# EAGLE board Rev_must_do_it,,,,,,,,,,, (EAGLE 9.3.0), part 1 of 2
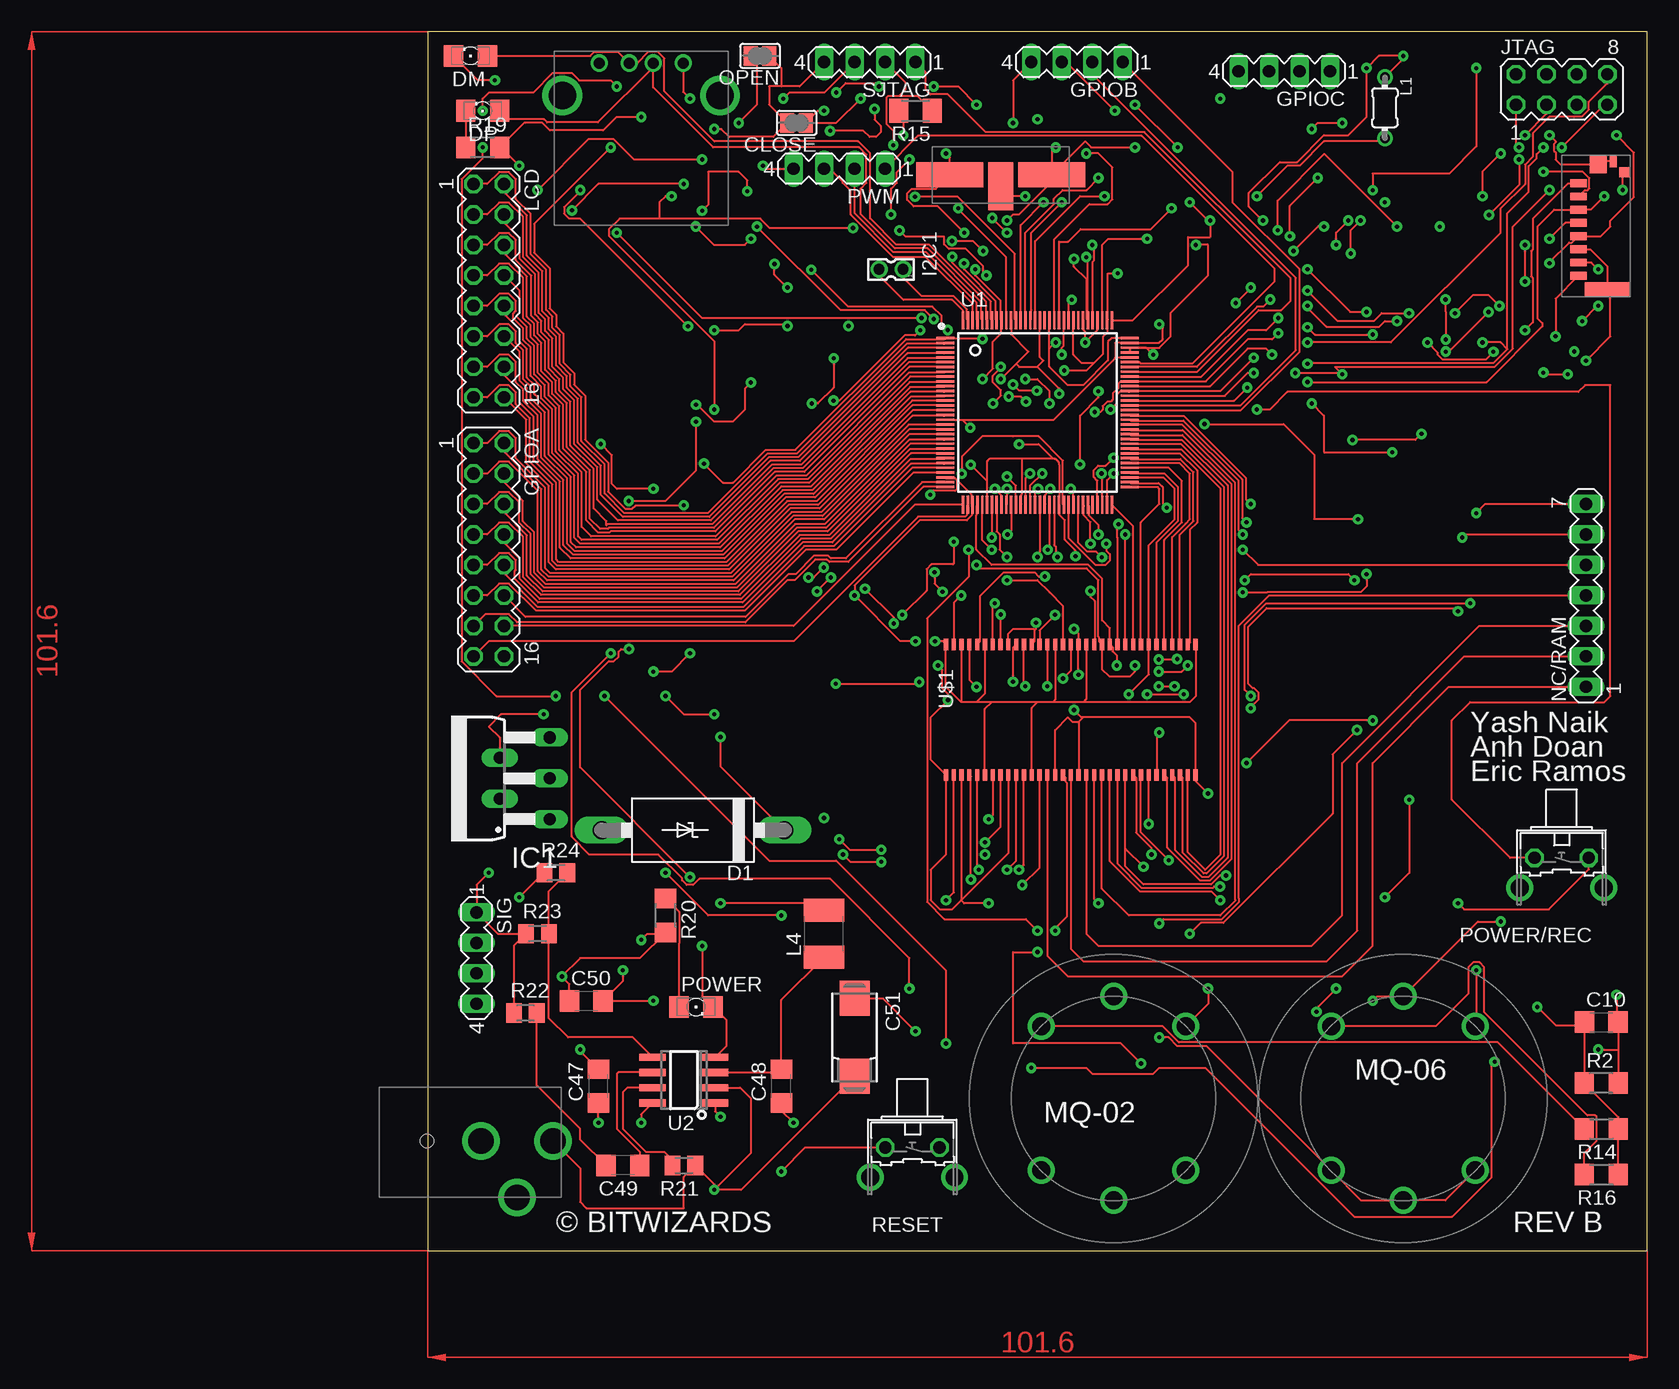
[diagram p4: board, top side]
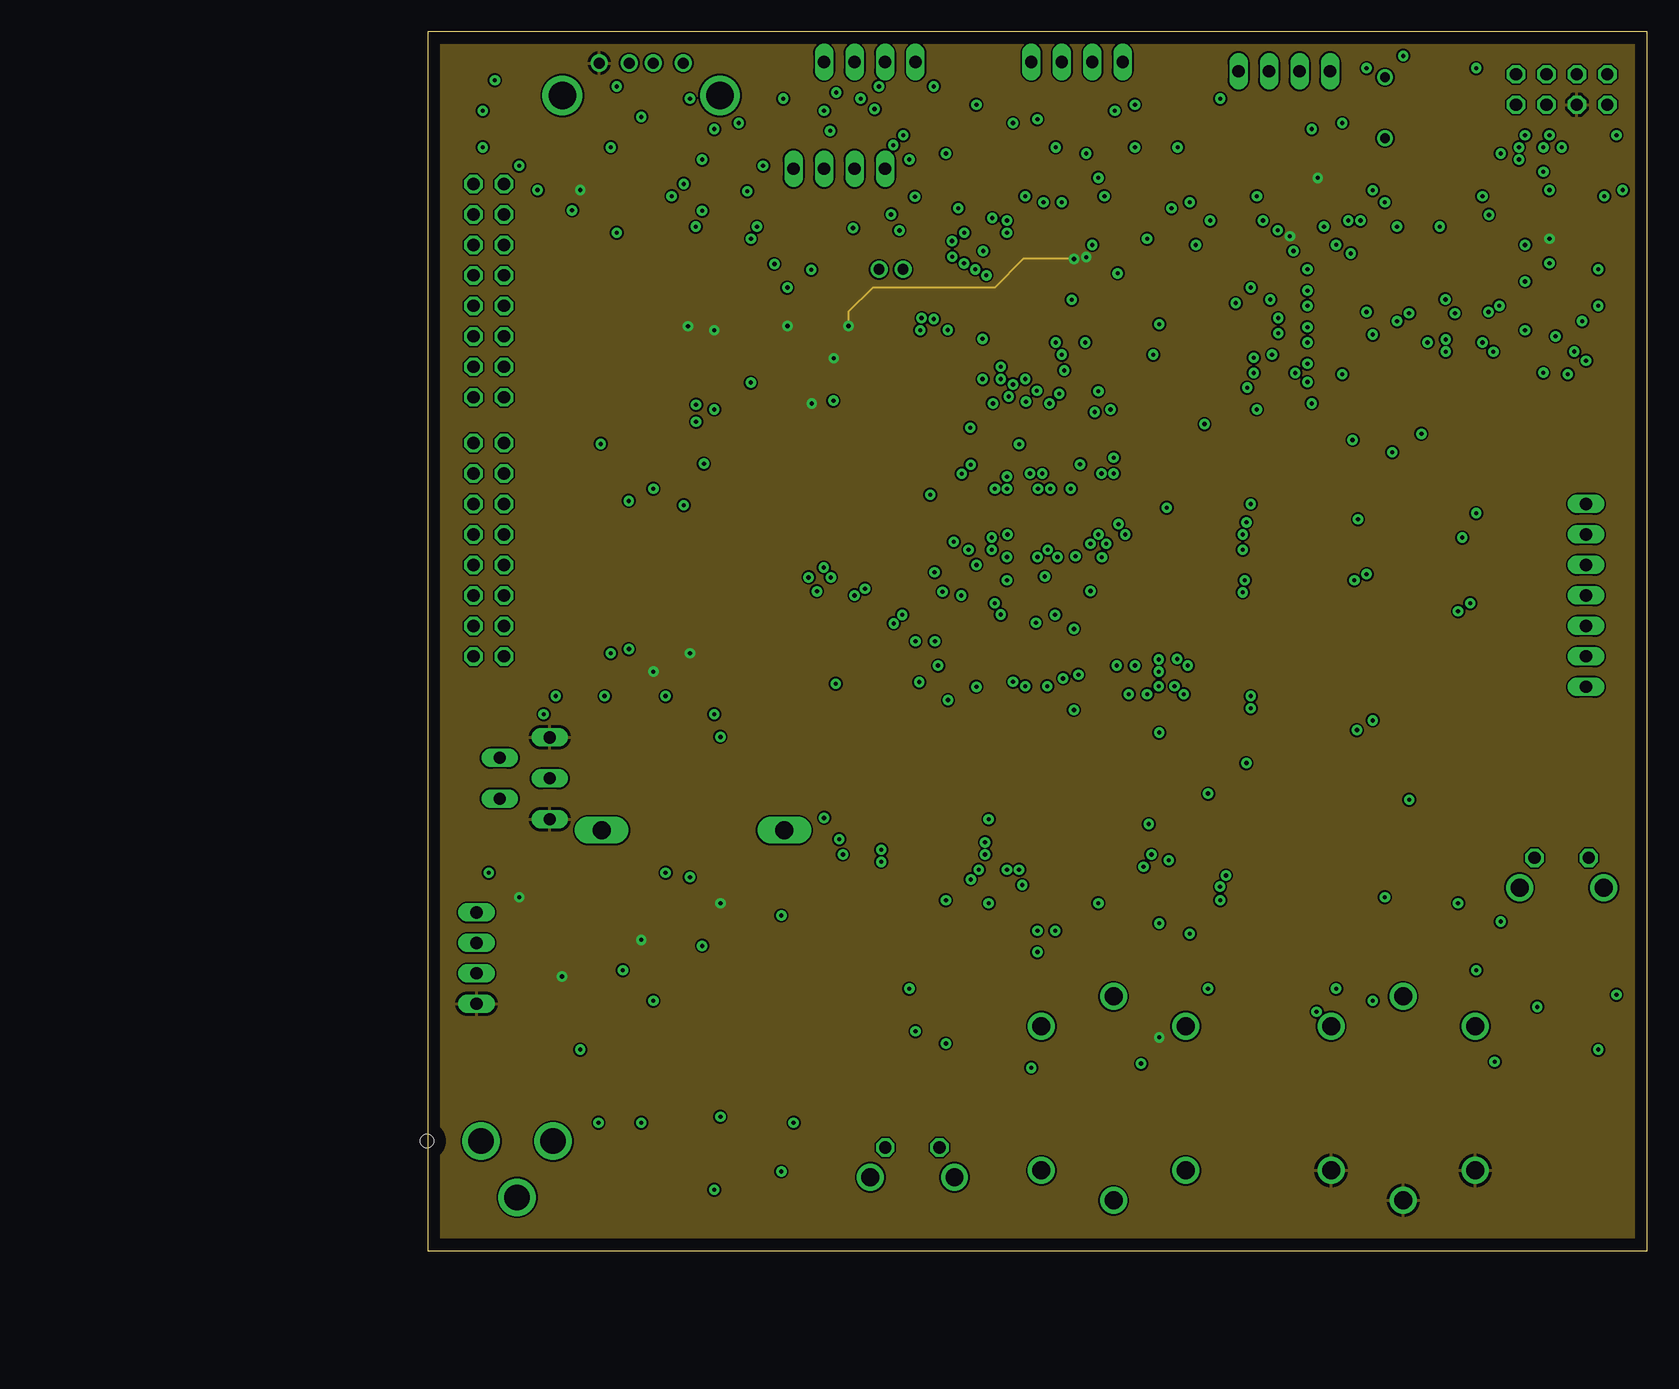
[diagram p5: board, inner layer +5VEXT]
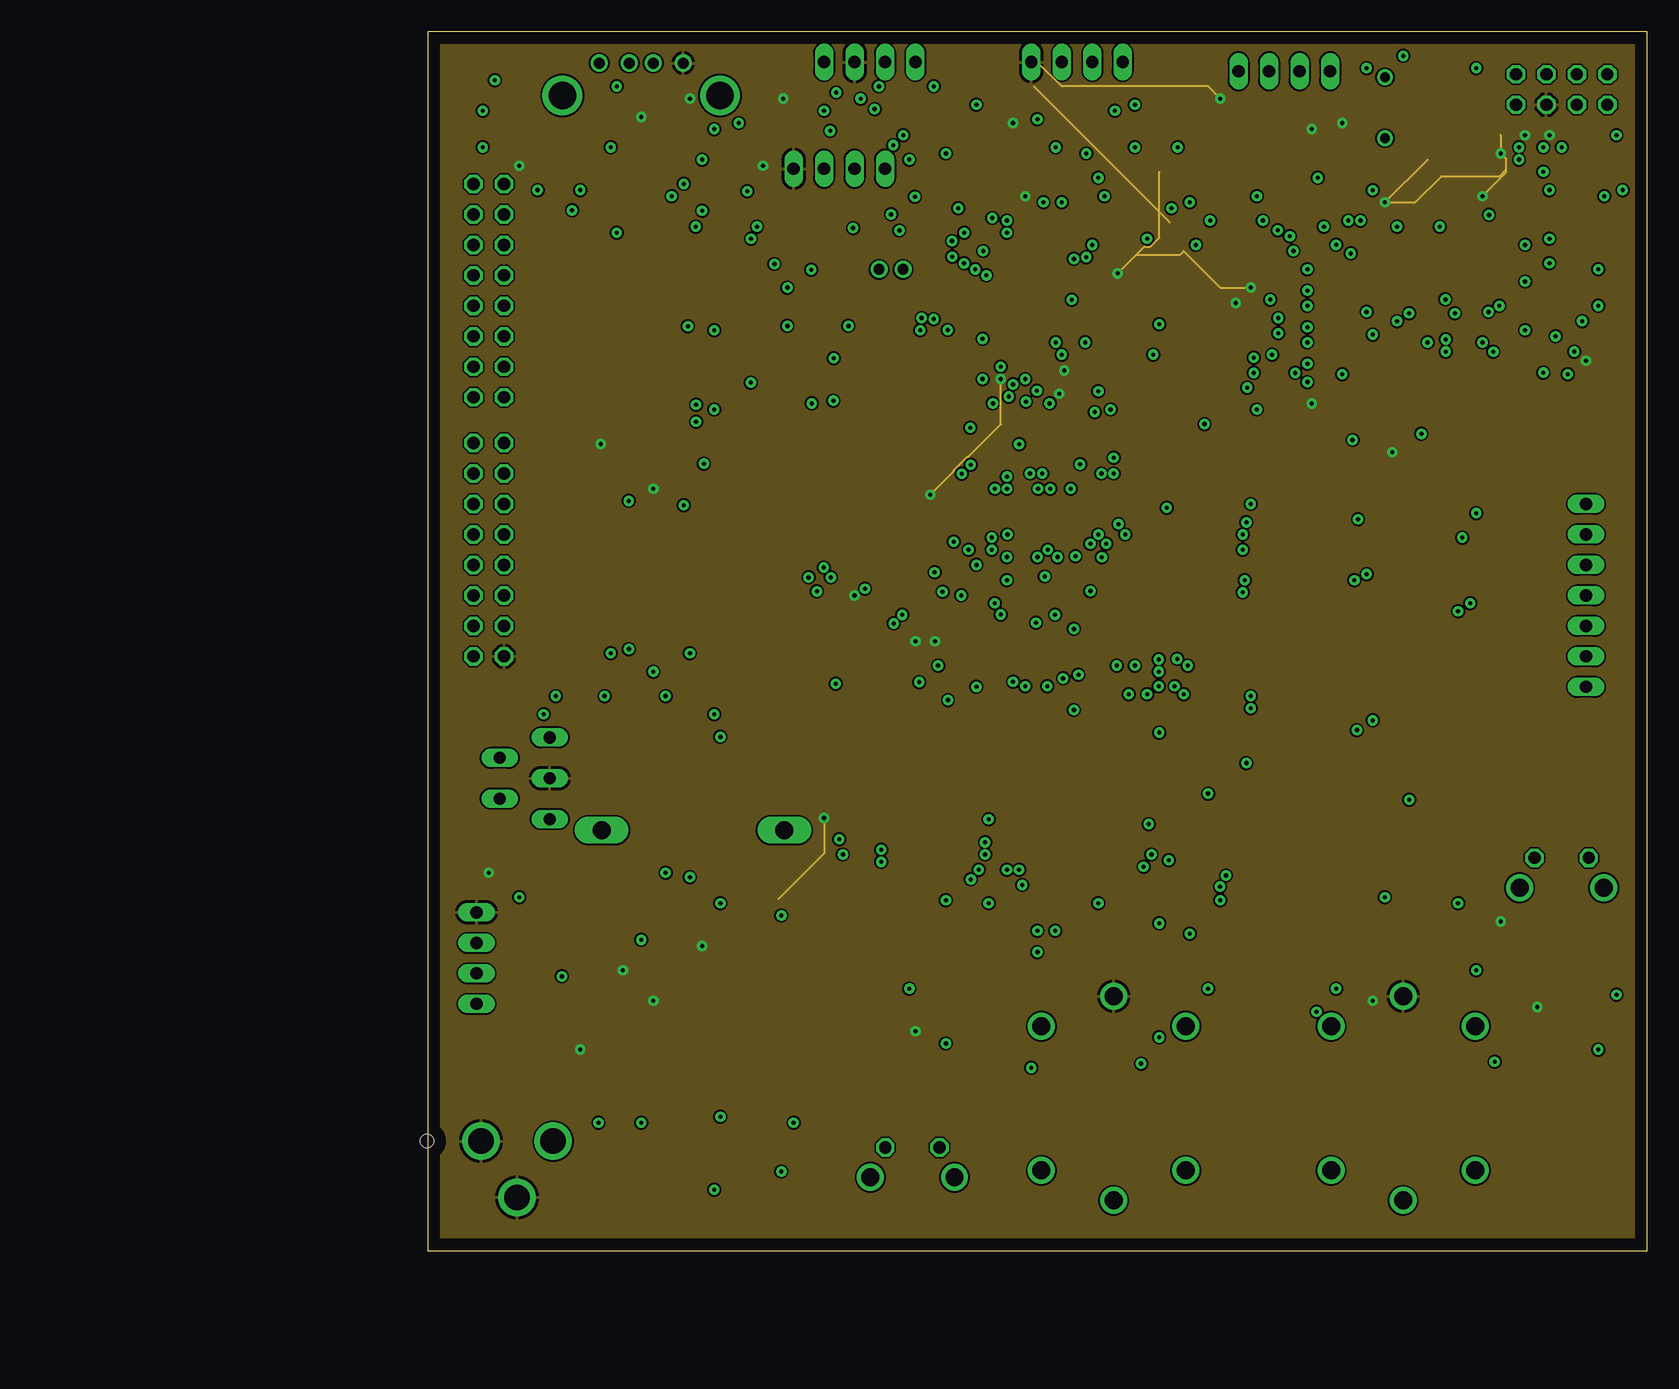
[diagram p6: board, inner layer GND]
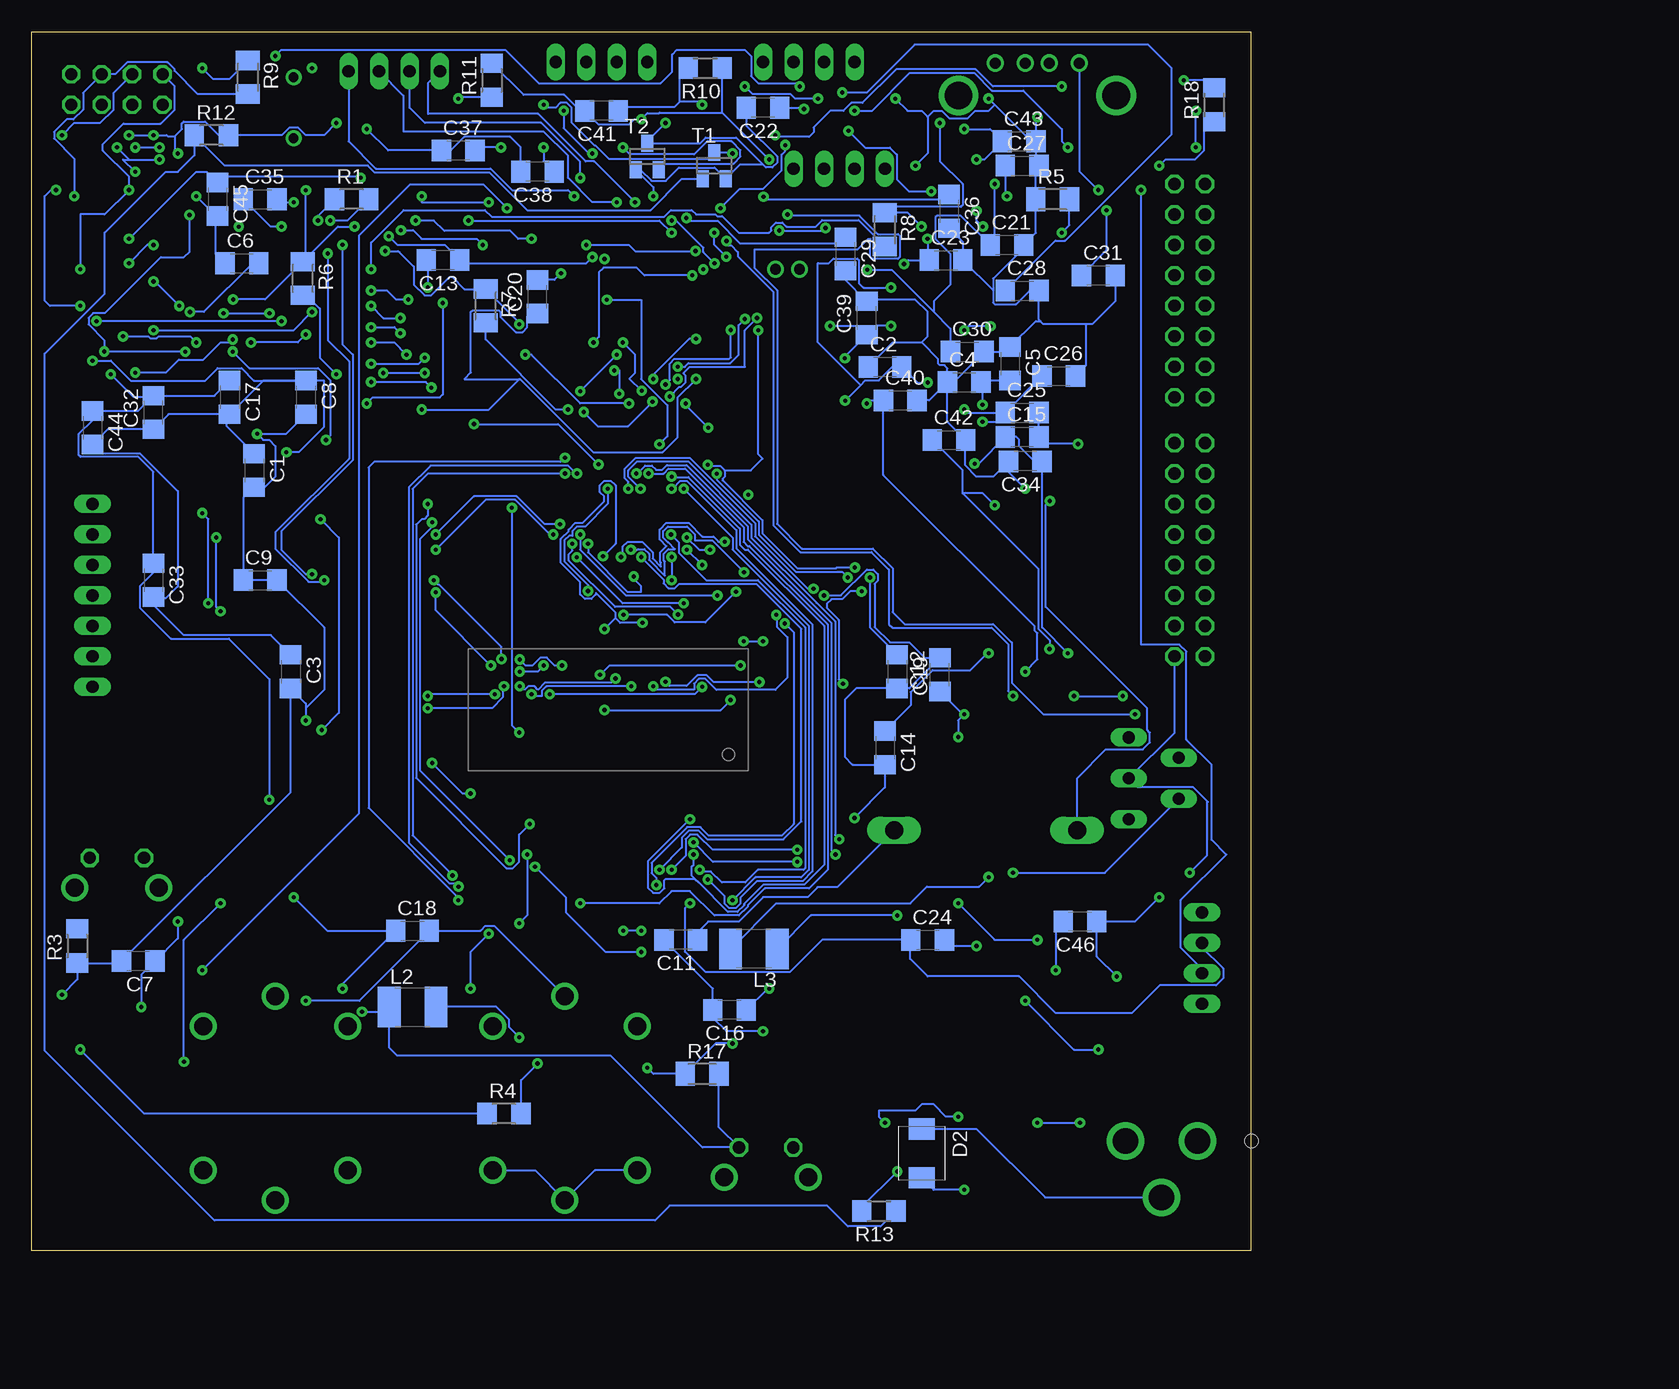
[diagram p7: board, bottom side, seen from below]

Size 101.6 x 101.6 mm. Coordinates in mm from the lower left corner, seen from the top.
Outline: 0,0 101.6,0 101.6,101.6 0,101.6 0,0
Copper layers (1*2*15*16): Top 0.035559375mm / dielectric 62mil / +5VEXT 0.035559375mm / dielectric 62mil / GND 0.035559375mm / dielectric 62mil / Bottom 0.035559375mm
Design rules "cmpe492-4Layer *": minimum track width 6mil, minimum drill 8mil, track to track 6mil, track to pad 6mil, pad to pad 6mil, via to via 6mil, smd to smd 6mil, copper to edge 40mil, drill to drill 20mil, minimum pad ring 10mil, minimum via ring 10mil, stop-mask expansion 4mil, vias tented up to drill 0mil, thermal gap 10mil

## Footprints (pad centres in the part's own frame; a part is rotated, then mirrored left to right if it is on the bottom)
C1206 = smd 1.6 x 1.8: 1 -1.4,0; 2 1.4,0
085CS_1AR = smd 2.9 x 2.5: + 3.25,0; - -3.25,0
SJ = smd 1.168 x 1.6: 1 -0.762,0; 2 0.762,0
C4111-15 = drill 1.499 long: A 7.62,0; C -7.62,0
SMBJ = smd 1.78 x 2.16: A 2.04,0; C -2.03,0
LED_1206 = smd 1.6 x 1.803: A -1.422,0; C 1.422,0
MA08-2 = drill 1.016 octagon: 1 -8.89,-1.27; 2 -8.89,1.27; 3 -6.35,-1.27; 4 -6.35,1.27; 5 -3.81,-1.27; 6 -3.81,1.27; 7 -1.27,-1.27; 8 -1.27,1.27; 9 1.27,-1.27; 10 1.27,1.27; 11 3.81,-1.27; 12 3.81,1.27; 13 6.35,-1.27; 14 6.35,1.27; 15 8.89,-1.27; 16 8.89,1.27
MA04-1 = drill 1.016 long: 1 -3.81,0; 2 -1.27,0; 3 1.27,0; 4 3.81,0
332-02 = drill 0.9 pad 1.27: 1 0,-1; 2 0,1
T05D = drill 1.016 long: 1 -3.404,-5.08; 2 -1.702,-0.914; 3 0,-5.08; 4 1.702,-0.914; 5 3.404,-5.08
MA04-2 = drill 1.016 octagon: 1 -3.81,-1.27; 2 -3.81,1.27; 3 -1.27,-1.27; 4 -1.27,1.27; 5 1.27,-1.27; 6 1.27,1.27; 7 3.81,-1.27; 8 3.81,1.27
LAL02 = drill 0.8 pad 1.3: 1 -2.54,0; 2 2.54,0
L1812 = smd 1.9 x 3.4: 1 -1.95,0; 2 1.95,0
MA07-1 = drill 1.016 long: 1 -7.62,0; 2 -5.08,0; 3 -2.54,0; 4 0,0; 5 2.54,0; 6 5.08,0; 7 7.62,0
B3F-31XX = drill 1.016 octagon: 1 -2.261,-1.245; 2 2.261,-1.245 | drill 1.499 pad 2.159: 3 -3.505,1.245; 4 3.505,1.245
R1206 = smd 1.6 x 1.803: 1 -1.422,0; 2 1.422,0
M1206 = smd 1.6 x 2: 1 -1.4,0; 2 1.4,0
M0805 = smd 1.3 x 1.6: 1 -0.95,0; 2 0.95,0
SOT23 = smd 1 x 1.4: 1 -0.95,-1.1; 2 0.95,-1.1; 3 0,1.1
QFP40P1600X1600X160-128N = smd 1.5 x 0.2: 1 -7.7,6.2; 2 -7.7,5.8; 3 -7.7,5.4; 4 -7.7,5; 5 -7.7,4.6; 6 -7.7,4.2; 7 -7.7,3.8; 8 -7.7,3.4; 9 -7.7,3; 10 -7.7,2.6; 11 -7.7,2.2; 12 -7.7,1.8; 13 -7.7,1.4; 14 -7.7,1; 15 -7.7,0.6; 16 -7.7,0.2; 17 -7.7,-0.2; 18 -7.7,-0.6; 19 -7.7,-1; 20 -7.7,-1.4; 21 -7.7,-1.8; 22 -7.7,-2.2; 23 -7.7,-2.6; 24 -7.7,-3; 25 -7.7,-3.4; 26 -7.7,-3.8; 27 -7.7,-4.2; 28 -7.7,-4.6; 29 -7.7,-5; 30 -7.7,-5.4; 31 -7.7,-5.8; 32 -7.7,-6.2; 65 7.7,-6.2; 66 7.7,-5.8; 67 7.7,-5.4; 68 7.7,-5; 69 7.7,-4.6; 70 7.7,-4.2; 71 7.7,-3.8; 72 7.7,-3.4; 73 7.7,-3; 74 7.7,-2.6; 75 7.7,-2.2; 76 7.7,-1.8; 77 7.7,-1.4; 78 7.7,-1; 79 7.7,-0.6; 80 7.7,-0.2; 81 7.7,0.2; 82 7.7,0.6; 83 7.7,1; 84 7.7,1.4; 85 7.7,1.8; 86 7.7,2.2; 87 7.7,2.6; 88 7.7,3; 89 7.7,3.4; 90 7.7,3.8; 91 7.7,4.2; 92 7.7,4.6; 93 7.7,5; 94 7.7,5.4; 95 7.7,5.8; 96 7.7,6.2 | smd 0.2 x 1.5: 33 -6.2,-7.7; 34 -5.8,-7.7; 35 -5.4,-7.7; 36 -5,-7.7; 37 -4.6,-7.7; 38 -4.2,-7.7; 39 -3.8,-7.7; 40 -3.4,-7.7; 41 -3,-7.7; 42 -2.6,-7.7; 43 -2.2,-7.7; 44 -1.8,-7.7; 45 -1.4,-7.7; 46 -1,-7.7; 47 -0.6,-7.7; 48 -0.2,-7.7; 49 0.2,-7.7; 50 0.6,-7.7; 51 1,-7.7; 52 1.4,-7.7; 53 1.8,-7.7; 54 2.2,-7.7; 55 2.6,-7.7; 56 3,-7.7; 57 3.4,-7.7; 58 3.8,-7.7; 59 4.2,-7.7; 60 4.6,-7.7; 61 5,-7.7; 62 5.4,-7.7; 63 5.8,-7.7; 64 6.2,-7.7; 97 6.2,7.7; 98 5.8,7.7; 99 5.4,7.7; 100 5,7.7; 101 4.6,7.7; 102 4.2,7.7; 103 3.8,7.7; 104 3.4,7.7; 105 3,7.7; 106 2.6,7.7; 107 2.2,7.7; 108 1.8,7.7; 109 1.4,7.7; 110 1,7.7; 111 0.6,7.7; 112 0.2,7.7; 113 -0.2,7.7; 114 -0.6,7.7; 115 -1,7.7; 116 -1.4,7.7; 117 -1.8,7.7; 118 -2.2,7.7; 119 -2.6,7.7; 120 -3,7.7; 121 -3.4,7.7; 122 -3.8,7.7; 123 -4.2,7.7; 124 -4.6,7.7; 125 -5,7.7; 126 -5.4,7.7; 127 -5.8,7.7; 128 -6.2,7.7
SOIC8 = smd 0.6 x 2.2: 1 -1.905,-2.6; 2 -0.635,-2.6; 3 0.635,-2.6; 4 1.905,-2.6; 5 1.905,2.6; 6 0.635,2.6; 7 -0.635,2.6; 8 -1.905,2.6
TSOP66 = smd 0.965 x 0.35: 1 0.279,0; 2 0.279,-0.65; 3 0.279,-1.3; 4 0.279,-1.95; 5 0.279,-2.6; 6 0.279,-3.25; 7 0.279,-3.9; 8 0.279,-4.55; 9 0.279,-5.2; 10 0.279,-5.85; 11 0.279,-6.5; 12 0.279,-7.15; 13 0.279,-7.8; 14 0.279,-8.45; 15 0.279,-9.1; 16 0.279,-9.75; 17 0.279,-10.4; 18 0.279,-11.05; 19 0.279,-11.7; 20 0.279,-12.35; 21 0.279,-13; 22 0.279,-13.65; 23 0.279,-14.3; 24 0.279,-14.95; 25 0.279,-15.6; 26 0.279,-16.25; 27 0.279,-16.9; 28 0.279,-17.55; 29 0.279,-18.2; 30 0.279,-18.85; 31 0.279,-19.5; 32 0.279,-20.15; 33 0.279,-20.8; 34 11.166,-20.8; 35 11.166,-20.15; 36 11.166,-19.5; 37 11.166,-18.85; 38 11.166,-18.2; 39 11.166,-17.55; 40 11.166,-16.9; 41 11.166,-16.25; 42 11.166,-15.6; 43 11.166,-14.95; 44 11.166,-14.3; 45 11.166,-13.65; 46 11.166,-13; 47 11.166,-12.35; 48 11.166,-11.7; 49 11.166,-11.05; 50 11.166,-10.4; 51 11.166,-9.75; 52 11.166,-9.1; 53 11.166,-8.45; 54 11.166,-7.8; 55 11.166,-7.15; 56 11.166,-6.5; 57 11.166,-5.85; 58 11.166,-5.2; 59 11.166,-4.55; 60 11.166,-3.9; 61 11.166,-3.25; 62 11.166,-2.6; 63 11.166,-1.95; 64 11.166,-1.3; 65 11.166,-0.65; 66 11.166,0
CRYSTAL = smd 5.6 x 2.1: (I/O) 4.25,0; I/O -4.25,0 | smd 2.1 x 4: GND 0,-0.95
SDCARD = smd 0.66 x 1.375: 1 9.45,-1.4; 2 8.35,-1.4; 3 7.25,-1.4; 4 6.15,-1.4; 5 5.05,-1.4; 6 3.95,-1.4; 7 2.85,-1.4; 8 1.75,-1.4 | smd 1.2 x 3.79: G1 0.6,-3.82 | smd 1.45 x 1.4: G2 11.025,-3.05 | smd 1 x 0.6: G3 11.3,-4.3 | smd 0.85 x 0.95: G4 10.375,-5.275
USB2.0 = drill 2.3: 5 -6.57,0; 6 6.57,0 | drill 0.92: D+ 1,2.71; D- -1,2.71; GNC 3.5,2.71; VCC -3.5,2.71
SENSOR = drill 1.5: 1 -6.01,6.01; 2 0,8.5; 3 6.01,6.01; 4 6.01,-6.01; 5 0,-8.5; 6 -6.01,-6.01
DC_POWER = drill 2.1: GROUND2 8.5,0; GROUND3 11.5,-4.7; POWER 14.5,0 | hole 1.1: 4,0

## Placement (x,y rotation side)
C1  10uF/10V  [C1206]  83.06,65.02 270 bottom
C2  100nF  [C1206]  30.48,73.66 0 bottom
C3  10uF/10V  [C1206]  80.01,48.26 270 bottom
C4  100nF  [C1206]  23.88,72.39 0 bottom
C5  100nF  [C1206]  20.07,73.91 270 bottom
C6  100nF  [C1206]  84.07,82.3 0 bottom
C7  100nF  [C1206]  92.71,24.13 180 bottom
C8  100nF  [C1206]  78.74,71.12 270 bottom
C9  100nF  [C1206]  82.55,55.88 0 bottom
C10  100nF  [C1206]  97.79,19.05 0 top
C11  22uF/6.3V  [C1206]  47.5,25.91 180 bottom
C12  22uF/6.3V  [C1206]  25.91,48.01 90 bottom
C13  100nF  [C1206]  67.31,82.55 180 bottom
C14  22uF/6.3V  [C1206]  30.48,41.91 270 bottom
C15  22uF/6.3V  [C1206]  19.05,67.82 0 bottom
C16  22uF/6.3V  [C1206]  43.43,20.07 180 bottom
C17  22uF/6.3V  [C1206]  85.09,71.12 270 bottom
C18  22uF/6.3V  [C1206]  69.85,26.67 0 bottom
C19  22uF/6.3V  [C1206]  29.46,48.26 270 bottom
C20  100nF  [C1206]  59.44,79.5 90 bottom
C21  100nF  [C1206]  20.32,83.82 0 bottom
C22  100nF  [C1206]  40.64,95.25 180 bottom
C23  100nF  [C1206]  25.4,82.55 0 bottom
C24  22uF/6.3V  [C1206]  26.92,25.91 0 bottom
C25  22uF/6.3V  [C1206]  19.05,69.85 0 bottom
C26  22uF/6.3V  [C1206]  16,72.9 0 bottom
C27  22uF/6.3V  [C1206]  19.05,90.42 0 bottom
C28  100pF  [C1206]  19.05,80.01 0 bottom
C29  NA  [C1206]  33.78,83.06 270 bottom
C30  22uF/6.3V  [C1206]  23.62,74.93 0 bottom
C31  100nF  [C1206]  12.7,81.28 0 bottom
C32  22uF/6.3V  [C1206]  91.44,69.85 90 bottom
C33  22uF/6.3V  [C1206]  91.44,55.88 270 bottom
C34  22uF/6.3V  [C1206]  18.8,65.79 180 bottom
C35  100nF  [C1206]  82.55,87.63 0 bottom
C36  1uF  [C1206]  25.15,86.61 270 bottom
C37  10pF  [C1206]  66.04,91.69 0 bottom
C38  10pF  [C1206]  59.44,89.92 180 bottom
C39  22uF/6.3V  [C1206]  32,77.72 90 bottom
C40  22uF/6.3V  [C1206]  29.21,70.87 0 bottom
C41  22pF  [C1206]  54.1,95 180 bottom
C42  22uF/6.3V  [C1206]  25.15,67.56 0 bottom
C43  22uF/6.3V  [C1206]  19.3,92.46 0 bottom
C44  22uF/6.3V  [C1206]  96.52,68.58 270 bottom
C45  22uF/6.3V  [C1206]  86.11,87.63 270 bottom
C46  22uF/6.3V  [C1206]  14.22,27.43 180 bottom
C47  100nF  [C1206]  14.22,13.72 90 top
C48  10nF  [C1206]  29.46,13.72 90 top
C49  3.3nF  [C1206]  16.26,7.11 180 top
C50  22uF/6.3V  [C1206]  13.21,20.83 0 top
C51  470uF  [085CS_1AR]  35.56,17.78 270 top
CLOSE  [SJ]  30.73,93.98 180 top
D1  1N5908  [C4111-15]  22.1,35.05 180 top
D2  SMBJ16A  [SMBJ]  27.43,8.13 270 bottom
DM  [LED_1206]  3.56,99.57 180 top
DP  [LED_1206]  4.57,95 180 top
GPIOA  [MA08-2]  5.08,58.42 270 top
GPIOB  [MA04-1]  54.1,99.06 180 top
GPIOC  [MA04-1]  71.37,98.3 180 top
I2C1  332-02  [332-02]  38.61,81.79 90 top
IC1  LM2596T  [T05D]  5.08,39.37 90 top
JTAG  [MA04-2]  94.49,96.77 0 top
L1  22uH/1.3A/SW68  [LAL02]  79.76,95.25 270 top
L2  470nH/1812/1.76R/250mA  [L1812]  69.85,20.32 0 bottom
L3  2.2uH/1812/3A  [L1812]  41.4,25.15 180 bottom
L4  10uH/2.3A  [L1812]  33.02,26.42 90 top
LCD  [MA08-2]  5.08,80.01 270 top
NC/RAM  [MA07-1]  96.52,54.61 90 top
OPEN  [SJ]  27.69,99.57 180 top
POWER  [LED_1206]  22.35,20.32 0 top
POWER/REC  TV-06B  [B3F-31XX]  94.49,31.5 180 top
PWM  [MA04-1]  34.29,90.17 180 top
R1  120R  [R1206]  74.93,87.63 0 bottom
R2  1k/1%  [R1206]  97.79,13.97 0 top
R3  1k/1%  [R1206]  97.79,25.4 90 bottom
R4  10k  [R1206]  62.23,11.43 0 bottom
R5  1M  [M1206]  16.51,87.63 0 bottom
R6  100k  [M1206]  78.99,81.03 270 bottom
R7  100k  [M1206]  63.75,78.74 270 bottom
R8  100k  [M1206]  30.48,85.09 270 bottom
R9  10k  [M1206]  83.57,97.79 270 bottom
R10  4.99k/1%  [R1206]  45.47,98.55 180 bottom
R11  1.1k/1%  [R1206]  63.25,97.54 90 bottom
R12  47k  [R1206]  86.61,92.96 0 bottom
R13  47k  [R1206]  30.99,3.3 180 bottom
R14  10k  [R1206]  97.79,10.16 180 top
R15  1k  [M1206]  40.64,95 180 top
R16  10k  [R1206]  97.79,6.35 180 top
R17  10k  [M1206]  45.72,14.73 0 bottom
R18  1k  [R1206]  3.05,95.5 90 bottom
R19  1k  [R1206]  4.57,91.95 0 top
R20  1k  [R1206]  19.81,27.94 270 top
R21  47k  [M0805]  21.34,7.11 180 top
R22  2.2k  [M0805]  8.13,19.81 0 top
R23  1.1k/1%  [M0805]  9.14,26.42 0 top
R24  4.99k/1%  [M0805]  10.67,31.5 0 top
RESET  TV-06B  [B3F-31XX]  40.39,7.37 180 top
SIG  [MA04-1]  4.06,24.38 270 top
SJTAG  [MA04-1]  36.83,99.06 180 top
T1  BC846  [SOT23]  44.7,90.42 0 bottom
T2  BC846  [SOT23]  50.29,91.19 0 bottom
U1  MCIMX233DAG4C  [QFP40P1600X1600X160-128N]  50.8,69.85 0 top
U2  MP1482  [SOIC8]  21.34,14.22 90 top
U$1  HY5DU121622D(L)T(P)-JTSOP-II  [TSOP66]  43.18,39.37 90 top
U$2  CRYSTAL  [CRYSTAL]  47.75,89.66 0 top
U$3  SDCARDDEVICE  [SDCARD]  94.49,79.5 90 top
U$4  USB2.0  [USB2.0]  17.78,96.27 0 top
U$5  SENSOR  [SENSOR]  81.28,12.7 0 top
U$6  SENSOR  [SENSOR]  57.15,12.7 0 top
U$7  DC_POWER  [DC_POWER]  -4.06,9.14 0 top

## Tracks (layer width: path | path; a pad name or v marks a point on that pad's centre or on a via)
2.5V  (via drill 0.35)
  Top 0.152: 54.61,44.45 54.23,44.07 | 54.23,44.07 U$1.18 | 54.61,44.45 63.5,44.45 63.98,43.97 U$1.33 63.98,39.14 v65.02,38.1 | U$1.15 52.28,43.39 53.34,44.45 53.72,44.07 54.23,44.07 | U$1.3 44.45,39.62 44.45,29.21 | U$1.9 48.38,33.14 44.45,29.21 | 49.53,66.04 46.99,66.04 arc90 46.6,65.65 U1.38 46.6,64.14 v45.24,65.5 | 49.53,66.04 52.07,66.04 | 52.07,66.04 arc-90 52.6,65.51 U1.53 52.62,62.13 52.62,61.35 53.09,60.88 53.09,59.25 53.97,58.37 v53.97,57.88 | U1.45 49.47,62.22 49.47,62.99 49.53,63.05 49.53,66.04 | v32.99,56.94 32.16,56.11 v31.73,56.11 | U$1.55 50.58,50.78 50.58,51.73 | v50.69,52.33 50.69,51.83 50.58,51.73 | U$1.58 48.38,51.43 48.77,51.82 50.48,51.82 50.58,51.73 | v53.85,51.82 54.23,51.43 U$1.49 54.22,50.53 v54.22,48 | 54.61,44.45 54.46,44.45 v53.85,45.06 | v42.52,48.77 42.88,48.41 42.88,46.86 43.35,46.39 v43.35,45.89 41.91,44.45 41.91,40.92 U$1.1 43.18,33.02 41.91,31.75 41.91,29.21 42.67,28.45 43.69,28.45 44.45,29.21 | U1.106 53.4,78.99 v53.66,79.25 | v49.28,67.21 50.9,67.21 52.07,66.04 | C10.2 99.19,18.8 | 99.19,18.8 99.19,16.76 | 99.19,16.76 99.19,13.99 R2.2 | v99.06,21.34 99.06,18.93 99.19,18.8 | v78.74,44.2 71.78,44.2 v68.22,40.64 | v97.54,16.76 99.19,16.76 | v88.39,78.23 85.09,74.93 v84.84,74.93 | v41.04,76.71 40.62,76.28 39.74,76.28 34.3,70.85 v33.8,70.85 | v26.92,72.35 26.42,71.84 26.42,70.1 25.4,69.09 23.88,69.09 22.46,70.51 v22.35,70.51 | v29.97,80.26 28.89,81.35 v28.89,82.23 | v33.53,93.32 36.3,93.32 36.81,92.81 37.36,92.81 37.74,93.2 37.74,93.74 37.23,94.26 v37.23,95.14 | v26.63,88.29 26.63,89.2 25.91,89.92 23.37,89.92 23.37,87.17 v22.86,86.66 | v22.32,85.34 23.85,83.82 26.42,83.82 v26.93,84.33
  Top 0.152: v82.8,68.07 82.3,67.56 v77.07,67.56 | v46.74,28.96 44.7,28.96 44.45,29.21
  Bottom 0.152: 43.84,65.03 44.23,65.41 45.16,65.41 v45.24,65.5 | 43.84,65.03 43.84,64.48 44,64.32 44,64.19 40.69,60.88 40.69,59.79 37.8,56.9 34.54,56.9 34.5,56.94 v32.99,56.94 | C19.1 31.73,51.92 v31.73,56.11 | 52.93,52.72 52.55,52.33 v50.69,52.33 | 52.93,52.72 52.93,53.18 54.56,54.81 54.56,54.7 54.95,54.31 55.49,54.31 55.88,54.7 55.88,55.7 57.5,57.32 57.5,59.32 56.84,59.98 56.84,60.09 56.28,60.65 55.68,60.65 53.89,62.44 53.89,62.88 54.24,63.23 54.24,63.77 53.86,64.16 53.31,64.16 52.93,63.77 52.93,58.92 v53.97,57.88 | v53.85,51.82 52.95,52.72 52.93,52.72 | v53.85,45.06 44.18,45.06 v43.35,45.89 | v42.52,48.77 53.45,48.77 v54.22,48 | v53.66,79.25 50.8,79.25 50.8,72.64 48.62,70.46 48.62,67.87 v49.28,67.21 | v99.06,21.34 97.79,22.61 R3.1 94.26,23.98 C7.2 80.01,38.23 80.01,38.61 80.01,45.21 C3.2 78.74,45.59 78.74,45.21 | v65.02,38.1 65.68,38.1 v68.22,40.64 | 78.74,45.21 77.22,46.74 77.22,51.95 C9.2 C9.1 83.95,62.73 83.25,63.44 | R4.1 92.2,11.43 v97.54,16.76 | C6.2 83.18,82.3 87.25,78.23 v88.39,78.23 | v84.84,74.93 83.46,73.55 77.72,73.55 76.71,72.53 76.71,67.92 v77.07,67.56 | 43.84,65.03 41.65,65.03 40.69,65.99 40.69,66.04 41.04,66.39 v41.04,76.71 | v33.8,70.85 32.51,72.14 | 32.51,72.14 32.12,72.53 30.98,72.53 29.86,73.66 C2.2 27.77,72.35 v26.92,72.35 | v22.35,70.51 22.35,72.27 C4.2 22.35,72.51 C5.2 | 32.51,72.14 36.07,75.69 36.07,82.3 35.17,82.3 34.78,82.69 32.79,82.69 32.65,82.55 32.65,80.64 32.27,80.26 v29.97,80.26 | v28.89,82.23 28.57,82.55 26.92,82.55 | 26.92,82.55 C23.1 | C22.1 37.34,95.25 v37.23,95.14 | v26.63,88.29 28.49,88.29 29.49,89.28 29.49,91.34 30.07,91.92 32.13,91.92 v33.53,93.32
  Bottom 0.152: v22.86,86.66 22.86,85.88 v22.32,85.34 | v26.93,84.33 26.93,82.56 26.92,82.55 | C8.2 80.39,68.07 v82.8,68.07 82.3,67.56 81.79,67.56 81.28,67.06 81.28,64.52 82.36,63.44 83.25,63.44 | C1.2 83.25,63.44 | SIG.2 4.06,25.28 2.31,23.52 2.31,22.7 2.89,22.12 7.59,22.12 9.91,19.81 16.26,19.81 19.3,22.86 26.92,22.86 28.39,24.32 28.39,25.85 C24.1 35.72,25.91 38.41,23.22 45.43,23.22 47.13,24.91 47.13,28.57 v46.74,28.96 | 78.74,45.21 v78.74,44.2
3.3VIO  (via drill 0.35)
  Top 0.152: 57.35,74.45 U1.92 | 57.35,74.45 52.16,69.25 U1.18 44.54,69.25 v45.21,68.58 | 57.35,74.45 57.28,74.45 57.28,75.65 U1.95 60.92,75.65 61.25,75.98 61.25,76.93 v60.96,77.22 | OPEN.2 27.43,99.06 27.43,95.5 v25.91,93.98 | v75.69,21.84 74.06,20.22 v74.06,19.92 | v81.79,37.59 81.79,31.5 v79.76,29.46 | v84.8,79.28 84.8,78.26 84.84,78.23 v84.84,75.94 | v92.96,73.18 93.09,73.05 v95,73.05 | v47.09,70.61 47.75,71.27 47.75,71.71 47.09,72.37 47.09,72.92 47.75,73.57 v47.75,73.66 | v42.16,77.64 41.42,78.38 34.39,78.38 v27.43,85.34 | v74.68,85.34 74.42,85.6 v72.14,83.31 | v78.74,88.37 78.74,89.77 85.11,89.77 87.38,92.03 v87.38,98.55
  Bottom 0.152: 71.8,19.81 71.8,16.94 71.12,16.26 53.34,16.26 45.7,8.61 RESET.1 44.32,10.28 R17.2 | 71.8,19.81 L2.1 | v25.91,93.98 25.91,90.8 24.02,88.91 24.02,87.12 24.15,86.98 29.86,86.98 30.48,86.36 R8.1 28.58,86.49 v27.43,85.34 | v75.69,21.84 75.69,22.23 C18.1 76.96,26.67 v79.76,29.46 | v74.06,19.92 71.9,19.92 71.8,19.81 | 91.5,71.19 92.71,69.98 C44.1 96.52,69.2 97.65,68.08 97.65,66.28 97.52,66.15 92.69,66.15 91.44,64.9 C33.1 91.44,56.5 92.57,55.38 92.57,53.59 89.99,51 85.16,51 81.79,47.63 v81.79,37.59 | 91.5,71.19 C32.2 86.36,71.25 C17.1 | R6.1 82.14,79.28 v84.8,79.28 | v92.96,73.18 90.4,73.18 89.31,74.26 87.28,74.26 85.85,75.69 85.09,75.69 v84.84,75.94 | v95,73.05 93.13,71.19 91.5,71.19 | v45.21,68.58 47.09,70.46 v47.09,70.61 | v47.75,73.66 47.17,73.66 46.86,73.97 43.38,73.97 42.67,74.68 42.67,77.13 v42.16,77.64 | R6.1 78.74,82.68 v78.74,88.37 | v87.38,98.55 86.49,97.67 85.09,97.67 R9.1 | R6.1 76.08,85.34 v74.68,85.34 | v60.96,77.22 60.96,77.35 R7.1 65.52,80.14 66.55,81.17 66.75,81.17 68.31,79.61 68.85,79.61 69.74,80.49 69.74,82.01 70.95,83.22 71.04,83.31 v72.14,83.31
3.3VREG  (via drill 0.35)
  Top 0.152: OPEN.1 29.46,98.55 29.46,97.03 | SJTAG.4 30.99,97.03 29.46,97.03 | 29.46,97.03 28.45,97.03 28.45,95.5 CLOSE.2 28.81,92.81 25.13,92.81 24.47,93.47 v23.88,93.47 | v22.86,90.93 17.19,90.93 15.51,92.61 13.36,92.61 v9.14,88.39
  Bottom 0.152: v23.88,93.47 21.72,93.47 C43.1 22.23,90.93 v22.86,90.93 | SIG.3 4.06,23.49 5.82,25.24 5.82,29.23 2.03,33.02 3.25,34.24 3.25,40.49 5.36,42.6 5.36,49.94 5.94,50.52 9.14,50.52 v9.14,88.39
+5EXT
  Bottom 0.152: U$6.6 54.66,6.69 U$6.5 59.64,6.69 U$6.4
+5VEXT  (via drill 0.35)
  Top 0.152: v54.86,82.8 55,82.67 U1.102 54.93,77.62 54.93,80.94 53.85,82.02 v53.85,82.65 | v74.17,89.41 71.84,87.08 v71.84,84.54 | JTAG.5 95.66,95.5 | U$5.4 84.8,4.2 U$5.5 77.76,4.2 U$5.6 64.91,17.05 62.47,17.05 61.74,17.78 v60.96,17.78 | v12.7,88.39 12.7,88.31 11.37,86.97 11.37,86.43 11.75,86.04 12.68,86.04 v21.68,77.05 | v23.88,76.71 25.91,76.71 26.42,77.22 29.82,77.22 v29.97,77.07 | v21.84,49.78 20.32,48.26 v18.8,48.26 | v33.83,74.38 33.83,71.92 32.51,70.61 v32,70.61 | R24.1 9.65,31.5 v7.62,29.46 | C50.1 11.81,22.23 v11.18,22.86 12.7,24.38 17.68,24.38 R20.2 19.71,26.42 18.29,26.42 v17.78,25.91 | L4.2 32.43,28.96 v24.38,28.96 | U$3.4 94.8,85.65 v93.47,84.33
  +5VEXT 0.152: v53.85,82.65 49.63,82.65 47.24,80.26 37.08,80.26 35.05,78.23 v35.05,77.07
  Bottom 0.152: v54.86,82.8 55.37,82.3 65.66,82.3 C13.1 67.18,83.82 71.12,83.82 v71.84,84.54 | v74.17,89.41 74.3,89.54 85.6,89.54 C45.1 86.99,89.92 87.88,89.92 v93.47,84.33 | v60.96,17.78 61.81,18.63 61.81,19.27 62.86,20.32 L2.2 | v35.05,77.07 32.75,77.07 C39.1 | U$4.VCC 14.28,89.97 v12.7,88.39 | v21.68,77.05 23.54,77.05 v23.88,76.71 | v29.97,77.07 31.26,77.07 C39.1 | v21.84,49.78 21.96,49.78 23.37,48.38 26.51,48.38 28.34,46.55 28.34,45.45 C14.1 | v18.8,48.26 17.78,49.28 17.78,51.46 18.01,51.69 18.01,52.04 30.61,64.65 C40.1 31.75,70.87 v32,70.61 | C39.1 33.83,74.5 v33.83,74.38 | v7.62,29.46 9.65,27.43 C46.1 12.82,24.51 v11.18,22.86 | v24.38,28.96 21.34,25.91 v17.78,25.91
  pour +5VEXT: -6.35,-6.35 107.95,-6.35 107.95,106.68 101.6,113.03 -7.62,113.03 -7.62,-5.08
A0
  Top 0.152: U1.76 58.57,67.98 62.88,67.98 66.95,63.9 66.95,32.64 65.15,30.84 64.39,30.84 61.63,33.6 61.63,39.4 U$1.29
A1
  Top 0.152: U1.75 58.57,67.58 62.85,67.58 66.65,63.78 66.65,32.77 65.02,31.14 64.52,31.14 62.28,33.38 62.28,39.4 U$1.30
A2
  Top 0.152: U$1.31 62.93,39.4 62.93,33.16 64.64,31.45 64.9,31.45 66.34,32.89 66.34,63.65 65,65 64.77,65.22 62.74,67.25 U1.74
A3
  Top 0.152: U1.73 58.57,66.78 62.78,66.78 66.04,63.52 66.04,33.02 64.77,31.75 63.33,33.19 U$1.32
A4
  Top 0.152: U$1.35 63.5,50.71 63.5,60.08 64.11,60.68 64.11,65.02 62.68,66.45 U1.72
A5
  Top 0.152: U1.71 58.57,65.98 62.72,65.98 63.8,64.9 63.8,60.81 62.68,59.69 U$1.36
A6
  Top 0.152: U1.70 62.62,65.65 63.5,64.77 63.5,60.96 63.14,60.6 63.14,60.58 62.03,59.47 U$1.37
A7
  Top 0.152: U1.69 61.75,65.25 62.84,64.16 62.84,60.71 61.38,59.25 U$1.38
A8
  Top 0.152: U1.68 58.57,64.78 61.38,64.78 62.53,63.63 62.53,60.83 60.73,59.03 U$1.39
A9  (via drill 0.35)
  Top 0.152: U1.67 61.28,64.45 62.23,63.5 62.23,60.96 60.08,58.81 U$1.40 60.08,48.04 v58.42,46.38 | U$1.63 45.13,47.58 v45.72,46.99
  Bottom 0.152: v45.72,46.99 46.33,46.38 v58.42,46.38
A10  (via drill 0.35)
  Top 0.152: U1.66 58.57,63.98 60.91,63.98 61.18,63.72 61.27,63.63 61.27,62.22 v61.57,61.91 | v60.96,43.18 60.73,42.95 U$1.28
  Bottom 0.152: v61.57,61.91 61.57,43.79 v60.96,43.18
A11
  Top 0.152: U1.65 60.81,63.65 60.96,63.5 60.96,62.23 59.43,60.7 U$1.41
A12
  Top 0.152: U$1.42 58.78,60.37 U1.64
BA0  (via drill 0.35)
  Top 0.152: U1.79 58.57,69.18 62.97,69.18 67.87,64.28 67.87,61.05 v68.22,60.7 | v61.75,32.54 59.43,34.87 U$1.26
  Bottom 0.152: v68.22,60.7 68.22,60.31 69.24,59.3 69.24,40.03 v61.75,32.54
BA1  (via drill 0.35)
  Top 0.152: U1.80 58.57,69.58 63,69.58 65.02,67.56 68.17,64.41 68.17,62.64 v68.58,62.23 | v60.09,35.56 U$1.27
  Bottom 0.152: v68.58,62.23 68.58,61.27 68.88,60.97 69.08,60.97 69.55,60.5 69.55,39.41 62.03,31.89 61.48,31.89 60.96,32.41 60.96,34.69 v60.09,35.56
BAT  (via drill 0.35)
  Top 0.152: v16.74,62.48 19.81,62.48 22.35,65.02 v22.35,69.09 | v39.3,85.02 39.81,84.51 43.03,84.51 43.03,83.87 43.42,83.48 44.85,83.48 46.28,82.05 46.28,81.56 v46.55,81.28 | v35.44,85.22 28.48,85.22 27.7,86 19.3,86 | 19.3,86 15.98,86 15.09,85.11 15.09,84.56 23.88,75.78 v23.88,70.1 | v20.32,87.88 19.81,87.88 19.3,87.38 19.3,86 | U1.100 55.8,76.71 v54.78,75.69 54.78,76.6 54.62,76.75 54.62,77.53 U1.103
  Bottom 0.152: D1.A 14.48,39.37 12.06,41.78 8.99,41.78 8.41,42.36 8.41,43.18 8.64,43.41 8.64,45.21 17.09,53.67 17.09,62.13 v16.74,62.48 | v22.35,69.09 21.21,69.09 C25.1 | v39.3,85.02 35.64,85.02 v35.44,85.22 | v23.88,70.1 23.62,69.85 C25.1 | C27.1 20.45,88.01 v20.32,87.88 | C26.1 C25.1 | v46.55,81.28 50.53,81.28 51.18,81.94 53.93,81.94 54.31,81.55 54.31,76.16 v54.78,75.69
CASN  (via drill 0.35)
  Top 0.152: U1.61 55.8,64.18 55.48,64.5 55.48,65.04 55.87,65.43 56.49,65.43 v57.15,66.08 | v66.04,29.21 65.33,29.92 59.39,29.92 56.83,32.48 U$1.22
  Bottom 0.152: v57.15,66.08 57.5,65.73 73.05,65.73 73.51,65.28 73.51,36.9 66.04,29.44 v66.04,29.21
CKE  (via drill 0.35)
  Top 0.152: U$1.44 57.48,59.4 57.47,59.42 57.47,60.46 v57.56,60.55 | v67.92,59.69 67.56,60.04 67.56,64.15 62.87,68.85 U1.78
  Bottom 0.152: v57.56,60.55 58.85,60.55 61.17,62.88 64.73,62.88 v67.92,59.69
CLK  (via drill 0.35)
  Top 0.152: U1.36 45.73,62.08 45.73,61.3 45.72,61.3 45.72,58.42 46.99,57.15 55.04,57.15 56.19,56.01 56.19,52.53 56.83,51.88 U$1.45 57.08,50.29 57.08,49.96 57.4,49.63 v57.4,48.77 | v60.91,49.28 62.4,49.28 v62.44,49.32 | v68.07,55.88 68.58,56.39 76.71,56.39 v77.22,55.88 | v77.72,85.85 76.91,85.04 v76.91,83.11
  Bottom 0.152: v60.91,49.28 60.41,48.77 59.86,48.77 59.2,49.43 58.66,49.43 58,48.77 v57.4,48.77 | v68.07,55.88 67.71,55.52 67.64,55.52 62.44,50.32 v62.44,49.32 | v77.22,55.88 77.22,55.73 78.5,55.73 81.28,58.51 81.28,59.87 75.13,66.02 75.13,74.11 76.91,75.9 v76.91,83.11 | v77.72,85.85 77.72,86.26 R1.1
CLKN  (via drill 0.35)
  Top 0.152: v45.72,57.15 46.02,56.84 54.91,56.84 55.88,55.88 55.88,51.17 55.93,51.11 55.93,50.78 U$1.46 56.18,48.47 56.79,47.86 58.53,47.86 58.93,48.26 v58.93,48.77 | v46.99,58.42 46.2,59.21 U1.37 | v60.91,48.26 62.81,48.26 v63.32,48.77 | v67.92,54.86 69.93,54.86 69.98,54.91 77.78,54.91 78.23,55.37 v78.23,56.39 | v75.69,83.83 75.69,84.84 v76.71,85.85
  Bottom 0.152: v45.72,57.15 v46.99,58.42 | v60.91,48.26 59.44,48.26 v58.93,48.77 | v63.32,48.77 67.92,53.36 v67.92,54.86 | R1.2 75.29,85.85 v76.71,85.85 | v75.69,83.83 75.69,75.54 74.83,74.67 74.83,65.89 80.77,59.94 80.77,58.43 78.73,56.39 v78.23,56.39
CS  (via drill 0.35)
  Top 0.152: U1.63 56.6,64.22 v57.15,64.77 | v66.52,31.27 66.02,31.27 65.28,30.53 59.64,30.53 58.13,32.04 58.13,33.52 | U$1.24 58.13,33.53 58.13,33.52 | v59.44,15.6 57.76,17.27 48.77,17.27 48.77,24.89 v50.8,24.89 | v59.65,32 58.13,33.52
  Bottom 0.152: v57.15,64.77 68.58,64.77 69.85,63.5 69.85,34.61 v66.52,31.27 | R4.2 60.81,14.23 v59.44,15.6 | v59.65,32 57.05,29.41 57.05,28.18 53.76,24.89 v50.8,24.89
D0  (via drill 0.35)
  Top 0.152: U1.41 47.8,62.96 v47.26,63.5 | v43.18,29.21 43.83,29.86 U$1.2
  Bottom 0.152: v47.26,63.5 43.18,59.42 43.18,58.42 36.83,52.07 36.83,31.75 37.47,31.11 41.27,31.11 v43.18,29.21
D1  (via drill 0.35)
  Top 0.152: U1.42 48.27,62.22 v48.27,63.5 | v45.26,30.95 45.26,39.52 U$1.4
  Bottom 0.152: v48.27,63.5 48.19,63.5 47.53,64.16 46.98,64.16 42.88,60.05 42.88,58.55 36.52,52.2 36.52,31.62 37.34,30.81 41.15,30.81 42.52,29.44 42.52,28.94 42.91,28.55 43.45,28.55 43.84,28.94 43.84,29.53 v45.26,30.95
D2  (via drill 0.35)
  Top 0.152: U1.43 48.6,59.98 v48.3,59.69 | v45.91,31.75 45.78,31.88 U$1.5
  Bottom 0.152: v48.3,59.69 47.65,59.03 47.65,58.15 45.38,55.88 41.07,55.88 37.13,51.94 37.13,31.88 37.26,31.75 41.07,31.75 42.13,30.7 44.08,30.7 44.98,31.6 45.77,31.6 v45.91,31.75
D3  (via drill 0.35)
  Top 0.152: U1.44 49,63.77 v48.26,64.51 | U$1.7 47.08,36.3 v46.74,35.95
  Bottom 0.152: v48.26,64.51 48.21,64.46 46.86,64.46 42.57,60.17 42.57,58.82 42.17,58.42 41.91,58.42 35.56,52.07 35.56,32.16 37.21,30.5 40.62,30.5 42.22,28.9 42.22,28.81 42.78,28.25 43.58,28.25 46.02,30.69 46.32,30.99 | v46.44,33.02 46.44,32.16 46.57,32.02 46.57,31.24 46.32,30.99 | v46.74,35.95 50.23,32.46 50.23,30.25 49.8,29.82 49.26,29.82 48.87,30.21 48.87,30.88 48.77,30.99 46.32,30.99
D4  (via drill 0.35)
  Top 0.152: U1.47 50.2,63.77 v51.2,64.77 | v34.6,33.02 35.21,32.41 v37.79,32.41 | v46.44,34.03 47.73,35.32 U$1.8
  Bottom 0.152: v51.2,64.77 51.12,64.77 50.46,65.43 49.91,65.43 49.56,65.08 49.06,65.08 48.66,65.47 47.01,65.47 41.91,60.38 41.91,59.28 34.95,52.32 34.95,33.37 v34.6,33.02 | v37.79,32.41 44.81,32.41 v46.44,34.03
D5  (via drill 0.35)
  Top 0.152: U1.48 50.6,63.24 v50.86,63.5 | v34.29,34.29 35.16,33.42 v37.79,33.42 | v48.26,31.75 49.03,32.52 U$1.10
  Bottom 0.152: v50.86,63.5 51.86,64.5 51.86,65.04 51.12,65.78 46.88,65.78 41.6,60.5 41.6,59.41 36.18,53.99 34.65,52.45 34.65,34.65 v34.29,34.29 | v37.79,33.42 44.85,33.42 46.12,34.69 46.71,34.69 47.09,34.3 47.09,32.91 v48.26,31.75
D6  (via drill 0.35)
  Top 0.152: U1.49 51,58.01 v50.8,57.81 | v49.27,31.75 49.68,32.16 U$1.11
  Bottom 0.152: v50.8,57.81 48.92,55.92 48.92,55.61 48.53,55.22 47.99,55.22 47.63,55.58 41.2,55.58 37.44,51.82 37.44,35.79 38.94,34.29 45.29,34.29 45.99,34.99 46.84,34.99 47.4,34.43 47.4,33.62 v49.27,31.75
D7  (via drill 0.35)
  Top 0.152: U1.50 51.47,62.22 51.47,62.99 51.87,63.39 v51.87,63.5 | v36.43,55.17 38.83,52.77 v38.83,52.27 | v49.53,30.48 50.98,31.93 U$1.13
  Bottom 0.152: v51.87,63.5 51.87,64.08 52.16,64.37 52.16,65.17 51.25,66.08 46.76,66.08 41.3,60.63 41.3,59.53 36.6,54.84 36.6,55 v36.43,55.17 | v38.83,52.27 38.1,51.55 38.1,35.56 39.06,34.59 45.16,34.59 45.87,35.3 46.96,35.3 49.93,32.33 49.93,31.48 49.53,31.08 v49.53,30.48
D8  (via drill 0.35)
  Top 0.152: U1.51 51.8,58.56 v51.66,58.42 | v42.23,56.54 42.23,55.59 v42.9,54.92 | v52.27,52.99 50.98,51.7 U$1.54
  Bottom 0.152: v51.66,58.42 51.12,58.42 51.07,58.47 50.53,58.47 50.14,58.08 50.14,57.58 48.82,56.25 48.82,57.43 48.92,57.53 48.92,58.08 48.53,58.47 47.99,58.47 48.55,59.03 48.58,59.03 48.96,59.42 48.96,59.96 48.58,60.35 46.98,60.35 46.33,59.7 46.33,59.2 44.89,59.2 v42.23,56.54 | v52.27,52.99 48.64,52.99 48.01,52.36 45.46,52.36 v42.9,54.92
D9  (via drill 0.35)
  Top 0.152: U1.52 52.2,58.81 52.31,58.69 52.31,57.97 v52.47,57.81 | v43.84,59.08 43.84,57.28 43.75,57.2 41.95,57.2 41.57,56.81 41.57,55.02 v39.54,52.99 | v49.78,47.03 49.68,47.14 U$1.56
  Bottom 0.152: v52.47,57.81 52.31,57.97 52.31,58.69 51.93,59.08 50.71,59.08 49.84,58.21 49.84,57.71 49.15,57.02 49.15,57.34 49.22,57.41 49.22,58.21 48.7,58.73 49.27,59.29 49.27,60.09 48.7,60.65 46.85,60.65 45.71,59.51 44.77,59.51 44.34,59.08 v43.84,59.08 | v39.54,52.99 39.48,52.93 39.48,52 38.61,51.13 38.61,47.75 39.62,46.74 44.54,46.74 45.45,47.65 45.99,47.65 46.38,47.26 46.38,46.76 49.51,46.76 v49.78,47.03
D10  (via drill 0.35)
  Top 0.152: U1.54 52.93,62.22 52.93,65.84 50.9,67.87 48.77,67.87 46.19,67.87 44.5,66.18 v44.5,64.75 | v33.59,56.11 v32.43,54.95 | v33.99,47.24 40.8,47.24 v40.95,47.39 | v48.77,47.42 48.77,49.95 48.78,49.96 48.78,50.29 U$1.57
  Bottom 0.152: v44.5,64.75 44.5,64.26 41,60.75 41,59.66 37.91,56.58 34.06,56.58 v33.59,56.11 | v32.43,54.95 33.39,54.95 34.03,54.3 34.94,54.3 35.33,53.91 35.33,53.57 34.34,52.58 34.34,47.6 v33.99,47.24 | v40.95,47.39 44.76,47.39 45.32,47.95 46.12,47.95 47,47.07 48.42,47.07 v48.77,47.42
D11  (via drill 0.35)
  Top 0.152: U$1.59 v47.74,53.02 | v56.54,58.92 56.54,58.35 56.83,58.06 56.83,57.51 56.45,57.13 55.65,57.13 53.4,59.38 U1.55
  Bottom 0.152: v47.74,53.02 48.37,53.65 52.97,53.65 56.83,57.51 56.83,58.06 56.54,58.35 v56.54,58.92
D12  (via drill 0.35)
  Top 0.152: U$1.60 47.08,53.79 v47.24,53.95 | v56.17,57.78 55.7,58.26 54.95,58.26 54.2,59.01 U1.57
  Bottom 0.152: v47.24,53.95 52.34,53.95 v56.17,57.78
D13  (via drill 0.35)
  Top 0.152: v51.42,56.19 51.42,56.18 50.93,56.18 50.57,56.54 47.99,56.54 46.03,54.58 46.03,50.78 U$1.62 | v55.22,58.92 55.22,60.72 54.67,61.27 54.67,62.08 U1.58
  Bottom 0.152: v55.22,58.92 55.22,58.19 51.94,54.91 50.8,54.91 50.8,55.37 51.52,56.09 v51.42,56.19
D15  (via drill 0.35)
  Top 0.152: U1.59 55.07,62.08 55.07,61.3 55.88,60.5 v55.88,59.69 | v44.45,54.61 43.83,53.99 U$1.65
  Bottom 0.152: v55.88,59.69 55.88,58.42 52.07,54.61 v44.45,54.61
DCDC_VDDA1  (via drill 0.35)
  Top 0.152: U1.96 57,76.05 56.68,75.73 56.68,74.21 54.61,72.14 53.34,72.14 51.8,73.68 51.8,75.2 | 51.8,75.2 U1.110 | 51.8,75.2 52.29,75.69 v52.32,75.69 | v50.76,71.67 49.29,71.67 v48.77,72.19 | v31.96,81.75 35.02,78.69 42.05,78.69 42.82,77.92 42.82,77.25 v43.33,76.73 | v21.34,88.9 14.22,88.9 v12.02,86.7
  Bottom 0.152: v50.76,71.67 51.77,72.69 51.31,73.15 51.31,74.68 v52.32,75.69 | v48.77,72.19 48.41,72.55 48.41,73.93 48.02,74.32 43.46,74.32 43.33,74.45 v43.33,76.73 | v31.96,81.75 29.93,81.75 26.42,78.23 | C30.1 25.02,76.84 26.42,78.23 | v21.34,88.9 21.34,84.2 C21.1 24.15,86.24 26.14,86.24 26.27,86.11 26.27,84.32 25.03,83.07 25.03,80.51 26.42,79.12 26.42,78.23 | v12.02,86.7 12.02,83.36 C31.1
DCDC_VDDD  (via drill 0.35)
  Top 0.152: U1.94 U1.93 | 12,34.49 12,34.54 | 12,34.54 12,46.55 v15.24,49.78 | v64.01,83.82 65.02,83.82 65.02,81.28 61.91,78.16 61.91,76.2 60.95,75.25 U1.94 | v70.82,85.05 70.82,87.5 74.72,91.4 v80.77,85.34 | v49.78,72.64 50.8,72.64 51.82,71.63 v51.82,70.61 | v23.01,65.6 24.6,64.01 25.45,64.01 28.17,66.74 30.62,66.74 39.86,75.98 43.03,75.98 U1.1 43.16,75.99 v46.23,75.99 | v60.45,74.68 59.88,75.25 U1.94 | 12,34.54 12,34.49 | 12,34.49 13.47,33.02 19.22,33.02 21.19,31.05 21.19,30.86 21.57,30.48 22.12,30.48 22.62,30.99 33.53,30.99 40.13,24.38 v40.13,21.84
  Bottom 0.152: v15.24,49.78 17.4,51.94 C34.1 18.03,65.79 19.3,67.06 19.3,67.56 19.56,67.82 C15.1 22.67,65.6 v23.01,65.6 | v64.01,83.82 64.52,84.33 69.09,84.33 69.81,85.05 v70.82,85.05 | v80.77,85.34 81.66,85.34 C35.1 | v46.23,75.99 46.78,75.99 49.78,72.99 v49.78,72.64 | v51.82,70.61 55.88,70.61 59.94,74.68 v60.45,74.68 | v40.13,21.84 40.26,21.84 C16.1
DEBUG
  Top 0.152: U1.89 64.11,73.25 69.24,78.38 71.12,78.38 71.89,79.16 71.89,81.04 59.72,93.22 46.48,93.22 43.33,96.37 41.89,96.37 41.51,96.76 41.51,98.19 SJTAG.1
DQM0  (via drill 0.35)
  Top 0.152: U1.46 49.8,62.89 49.84,62.93 49.84,64.42 v50.19,64.77 | v55.88,28.96 55.53,29.31 U$1.20
  Bottom 0.152: v50.19,64.77 48.93,64.77 48.53,65.17 47.13,65.17 42.27,60.3 42.27,59.08 41.91,58.73 41.78,58.73 35.26,52.2 35.26,31.75 36.8,30.2 40.49,30.2 41.91,28.78 41.91,28.68 42.66,27.94 44.7,27.94 46.74,29.97 48.26,29.97 49.28,28.96 v55.88,28.96
DQM1  (via drill 0.35)
  Top 0.152: U1.56 53.8,63.29 v53.59,63.5 | v55.22,54.97 55.22,54.51 55.58,54.15 55.58,50.58 U$1.47
  Bottom 0.152: v53.59,63.5 53.59,62.24 55.48,60.35 56.15,60.35 56.54,59.96 56.54,59.58 56.81,59.58 57.2,59.19 57.2,57.44 55.22,55.47 v55.22,54.97
DQS0  (via drill 0.35)
  Top 0.152: U1.39 v47,59.44 v46.99,59.43 | v45.06,58.42 45.06,56.15 41.6,52.7 41.6,29.08 43.05,27.64 49.84,27.64 v50.8,26.67 | v52.29,26.67 52.29,26.89 53.27,27.88 53.27,38.97 53.18,39.07 53.18,39.4 U$1.16
  Bottom 0.152: v46.99,59.43 45.98,58.42 v45.06,58.42 | v50.8,26.67 v52.29,26.67
DQS1  (via drill 0.35)
  Top 0.152: U1.40 47.4,59.95 47.65,59.7 47.65,58.42 v48.26,57.81 | U$1.51 52.93,53.75 51.82,54.86 50.8,55.88 v48.26,55.88
  Bottom 0.152: v48.26,57.81 v48.26,55.88
GND  (via drill 0.35)
  Top 0.152: U$1.34 63.98,46.2 63.5,45.72 54.61,45.72 | 54.61,45.72 52.07,45.72 | 52.07,45.72 50.8,45.72 | 50.8,45.72 46.99,45.72 | 46.99,45.72 45.72,45.72 | 45.72,45.72 44.45,45.72 | 44.45,45.72 43.18,46.99 U$1.66 42.92,50.8 v42.26,50.8 | U$1.64 44.45,50.51 44.45,45.72 | U$1.61 46.43,46.43 45.72,45.72 | U$1.52 52.28,45.93 52.07,45.72 | U$1.48 54.88,45.99 54.61,45.72 | U$1.12 50.33,45.25 50.8,45.72 | U$1.6 46.43,45.16 46.99,45.72 | 44.08,64.25 45.33,62.99 45.33,62.22 U1.35 45.33,62.08 45.33,61.27 44.92,60.87 40.98,60.87 35.56,55.45 v35.56,54.61 39.37,50.8 v40.64,50.8 | U1.118 48.6,76.37 50.04,74.93 49.02,73.91 | 49.02,73.91 49.28,73.66 50.8,73.66 | 50.8,73.66 51.31,74.17 51,74.48 U1.112 | U1.105 53.8,74.68 54.51,73.97 55.5,73.97 | JTAG.3 93.22,94.74 v91.44,92.96 | 55.5,73.97 56.25,74.71 56.25,76.16 56.6,76.51 U1.98 56.67,77.62 56.67,81.44 56.67,81.45 v57.49,81.45 | SJTAG.3 33.02,96.52 30.12,96.52 v29.61,96.01 | v27.94,90.42 28.19,90.17 PWM.4 | C10.1 96.39,18.8 | 96.39,18.8 96.39,13.99 R2.1 99.21,11.13 R14.1 R16.1 | v89.41,27.43 87.51,27.43 U$5.2 79.11,21.2 v78.74,20.83 | v92.46,20.32 93.98,18.8 96.39,18.8 | U$4.GNC 21.28,96.58 v21.84,96.01 | v96.52,74.17 98.55,76.2 98.55,79.86 U$3.G1 98.31,82.03 96.89,83.45 U$3.6 | v41.87,62.99 41.87,63.22 41.97,63.32 43.95,63.32 44.08,63.45 44.08,64.25 | 44.08,64.25 43.95,64.38 43.17,64.38 U1.30 | v47.75,72.64 49.02,73.91 | v52.62,71.42 52.62,71.84 50.8,73.66 | v68.58,80.26 68.58,80.23 v67.33,78.98 | v73.66,70.61 74.68,69.6 74.68,66.55 v80.37,66.55 | v18.8,63.5 15.75,63.5 15.34,63.91 15.34,66.3 v14.4,67.24 | v17.78,94.49 15.75,94.49 14.62,93.36 10.18,93.36 9.56,93.98 8.13,93.98
  Top 0.152: v53.04,73.36 54.9,73.36 55.5,73.97 | v73.66,93.47 74.17,93.98 v76.2,93.98 | v49.78,87.88 48.58,87.88 U$2.GND | 8.13,93.98 8.02,93.98 | v5.08,31.5 4.06,30.48 SIG.1 5.84,26.42 R23.1 7.18,25.4 R22.1 | v7.62,90.42 6.1,91.95 R19.2 8.03,93.98 8.13,93.98 | v89.41,91.44 87.88,89.92 v87.88,87.88 | GPIOB.4 48.77,97.54 v48.77,93.98 | U2.4 24.89,17.09 24.89,19.2 23.82,20.27 | 23.82,20.27 POWER.C | v16.26,23.37 16.26,22.48 C50.2 v18.8,20.83 | v22.86,25.4 22.86,21.23 23.82,20.27 | C51.- 37.9,21.03 v40.64,18.29 | v12.7,16.76 12.7,16.64 C47.2 | U$3.G3 97.81,90.8 U$3.G2 95,90.53 | 94.79,90.53 95,90.53 | v93.47,92.96 93.98,92.46 93.98,92.37 93.83,92.22 93.83,91.68 93.98,91.53 93.98,90.93 94.39,90.53 95,90.53
  GND 0.152: 89.41,92.96 v89.41,91.44 89.82,91.03 89.82,90.07 | 89.82,90.07 89.31,89.56 84.48,89.56 82.3,87.38 v79.76,87.38 83.31,90.93 | 89.82,90.07 89.82,89.82 v87.88,87.88 | 29.23,29.31 33.02,33.11 v33.02,36.07 | v68.58,80.26 66.04,80.26 62.99,83.31 62.65,82.97 59.01,82.97 v57.49,81.45 59.71,83.67 60.22,83.67 60.96,84.41 60.96,89.92 | v47.75,72.64 47.75,68.87 45.04,66.16 44.97,66.16 43.84,65.03 43.84,64.96 v41.87,62.99 | 61.83,85.7 50.5,97.03 | v66.04,96.01 65.02,97.03 52.83,97.03 50.8,99.06 GPIOB.4
  Bottom 0.152: v35.56,54.61 34.16,54.61 32,56.77 31.46,56.77 31.07,56.38 31.07,55.84 31.34,55.57 31.34,51.97 30.06,50.69 28.47,50.69 27.19,49.41 C12.2 28.45,46.86 C19.2 32.9,46.86 33.83,45.92 33.83,41.15 33.2,40.51 C14.2 30.48,38.61 v33.02,36.07 | v42.26,50.8 v40.64,50.8 | v53.04,73.36 52.62,73.36 v52.62,71.42 | v93.47,92.96 v91.44,92.96 90.34,92.96 90.23,92.86 89.69,92.86 | v29.61,96.01 28.6,95 27.43,95 26.92,94.49 | v27.94,90.42 26.92,91.44 26.92,94.49 | v89.41,27.43 89.41,26.03 C7.1 92.46,22.98 v92.46,20.32 | v78.74,20.83 74.29,20.83 C18.2 64.18,26.67 63.77,27.07 63.02,27.07 U$6.2 | 3.66,37.49 4.82,38.66 9.45,38.66 IC1.3 6.35,43.18 GPIOA.16 | 3.66,37.49 3.56,37.39 | v21.84,96.01 21.34,95.5 | 21.34,95.5 18.29,92.46 C43.2 | 26.92,94.49 26.42,95 25.75,95 25.13,94.38 23.57,94.38 22.95,95 21.84,95 21.34,95.5 | C3.1 81.66,51.31 88.9,51.31 91.44,53.85 91.44,54.36 | 91.44,54.36 C33.2 | C8.1 77.22,72.52 77.22,68.68 79.35,66.55 v80.37,66.55 | C8.1 82.29,72.52 C17.2 85.34,69.72 | 85.34,69.72 90.17,69.72 C32.1 95.25,68.45 C44.2 95.8,66.46 92.56,66.46 89.41,63.3 89.41,55.37 90.42,54.36 91.44,54.36 | C8.1 83.07,72.52 84.09,73.55 86.08,73.55 87.11,72.52 93.35,72.52 95,74.17 v96.52,74.17 | v87.88,87.88 86.23,86.23 | 86.23,86.23 C45.2 | C6.1 86.23,83.05 86.23,86.23 | C35.2 80.9,87.38 v79.76,87.38 | 84.84,92.96 R12.2 | C13.2 68.58,82.42 v68.58,80.26 | v73.66,70.61 73.15,71.12 67.56,71.12 67.33,71.36 v67.33,78.98 | C43.2 17.9,90.68 17.71,90.49 | 17.71,90.49 C27.2 | 17.71,90.49 17.91,90.29 R5.1 17.91,84.83 C21.2 18.92,83.56 21.48,81 21.48,80.03 | C36.2 24,84.07 C23.2 21.48,80.03 | 21.48,80.03 21.48,79.02 21.34,78.88 19.55,78.88 18.43,80.01 C28.2 17.65,77.59 17.53,77.47
  Bottom 0.152: C31.2 11.3,79.12 13.21,77.22 13.72,77.22 | 13.72,77.22 17.27,77.22 17.53,77.47 | C26.2 13.72,73.78 13.72,77.22 | 17.53,77.47 17.91,77.47 C5.1 20.45,74.93 C30.2 24.76,72.39 C4.1 | C29.2 33.78,80.9 32.07,79.19 | 32.07,79.19 C39.2 | C42.2 23.81,67.63 | 23.81,67.63 25.28,69.09 C4.1 | C4.1 26.8,70.87 C40.2 | 23.81,67.63 23.81,65.47 22.86,64.52 21.47,64.52 C34.2 20.2,64.9 v18.8,63.5 | C25.2 C15.2 17.07,67.24 v14.4,67.24 | C2.1 29.85,75.69 27.43,75.69 | 27.43,75.69 26.92,76.2 26.92,78.23 27.94,79.25 32,79.25 32.07,79.19 | C4.1 25.28,73.54 25.54,73.8 25.92,73.8 26.05,73.94 26.05,74.31 27.43,75.69 | v17.78,94.49 17.9,94.36 C43.2 | C1.1 85.34,68.71 85.34,69.72 | v57.49,81.45 58.03,80.9 C20.2 | C38.2 60.84,91.95 61.71,92.82 65.53,92.82 66.66,91.69 C37.1 71.88,91.69 v73.66,93.47 | R12.2 86.01,92.96 87.14,94.09 88.93,94.09 89.06,93.96 89.06,93.48 89.69,92.86 | v76.2,93.98 77.22,92.96 78.76,92.96 79.39,93.59 80.12,93.59 80.75,92.96 R12.2 | 40.66,90.53 42.55,90.53 T1.2 44.68,90.25 47.65,90.25 48.75,89.16 49.94,89.16 50.87,90.09 T2.1 49.78,88.63 v49.78,87.88 | 40.66,90.53 40.4,90.27 39.86,90.27 39.47,90.66 39.47,91.2 42.04,93.77 C22.2 | R11.1 65.94,96.11 v66.04,96.01 | 40.66,90.53 42.89,92.76 45.42,92.76 45.9,92.29 T2.3 50.29,92.46 v48.77,93.98 | 3.66,37.49 3.66,32.92 v5.08,31.5 | R18.1 3.91,93.22 3.91,91.68 4.66,90.93 7.11,90.93 v7.62,90.42 | 89.69,92.86 89.69,91.72 v89.41,91.44 | D2.C 22.86,10.16 17.14,4.44 U$7.GROUND3 | C46.2 16.26,26.8 v16.26,23.37 | C24.2 25.02,25.4 v22.86,25.4 | C11.2 44.83,21.84 C16.2 44.83,19.43 43.69,18.29 v40.64,18.29 | v18.8,20.83 14.73,16.76 v12.7,16.76
  pour GND: -5.08,-5.08 107.95,-5.08 116.84,3.81 116.84,106.68 -1.27,106.68 -6.35,101.6 -6.35,-3.81
GPMI_ALE
  Top 0.152: U1.20 40.11,68.45 32.91,61.25 30.45,61.25 25.37,56.17 10.07,56.17 9.47,56.77 9.47,63.48 6.35,66.6 GPIOA.2
GPMI_CE0N
  Top 0.152: U1.82 67.73,70.45 72.34,75.06 72.34,81.08 55.37,98.04 GPIOB.2
GPMI_CE1N
  Top 0.152: U1.81 67.76,70.05 72.64,74.93 72.64,81.79 67.06,87.38 67.06,89.92 GPIOB.1
GPMI_CLE
  Top 0.152: U1.19 40.08,68.85 32.78,61.55 30.32,61.55 25.24,56.48 10.2,56.48 9.78,56.9 9.78,63.6 7.34,66.04 7.34,67.72 6.76,68.3 5.94,68.3 4.95,67.31 GPIOA.1
GPMI_D00
  Top 0.152: U1.22 43.03,67.58 40.1,67.58 33.08,60.55 30.61,60.55 25.62,55.56 9.81,55.56 8.87,56.51 8.87,59.87 7.92,60.81 7.92,62.49 6.35,64.06 GPIOA.4
GPMI_D01
  Top 0.152: U1.23 40.2,67.25 33.2,60.25 30.74,60.25 25.75,55.26 9.69,55.26 8.56,56.39 8.56,59.74 7.62,60.68 7.62,62.36 6.76,63.22 5.94,63.22 4.95,62.23 GPIOA.5
GPMI_D02
  Top 0.152: U1.24 43.03,66.78 40.16,66.78 33.33,59.94 30.86,59.94 25.87,54.95 9.56,54.95 8.26,56.26 8.26,59.62 6.35,61.52 GPIOA.6
GPMI_D03
  Top 0.152: U1.25 40.27,66.45 33.45,59.64 30.99,59.64 26,54.65 9.44,54.65 7.95,56.13 7.95,59.49 6.76,60.68 5.94,60.68 4.95,59.69 GPIOA.7
GPMI_D04
  Top 0.152: U1.27 43.03,65.58 40.26,65.58 33.71,59.03 31.24,59.03 26.24,54.02 9.2,54.02 7.23,56 7.23,56.63 7.34,56.74 7.34,57.56 6.76,58.14 5.94,58.14 4.95,57.15 GPIOA.9
GPMI_D05
  Top 0.152: U1.26 43.03,65.98 40.22,65.98 33.58,59.33 31.12,59.33 26.11,54.33 9.32,54.33 7.64,56.01 7.64,57.69 6.35,58.98 GPIOA.8
GPMI_D06
  Top 0.152: U1.29 40.47,64.85 34.04,58.42 31.5,58.42 26.42,53.34 9.02,53.34 6.76,55.6 5.94,55.6 4.95,54.61 GPIOA.11
GPMI_D07
  Top 0.152: U1.28 40.36,65.25 33.83,58.73 31.37,58.73 26.29,53.65 9.15,53.65 6.35,56.44 GPIOA.10
GPMI_RDN
  Top 0.152: U1.31 41.19,64.05 34.85,57.71 33.58,57.71 33.39,57.9 32.16,57.9 30.64,56.39 30.05,56.39 26.49,52.83 8.13,52.83 GPIOA.12
GPMI_RDY0
  Top 0.152: U1.32 41.3,63.65 35.05,57.4 33.45,57.4 33.26,57.6 32.28,57.6 30.57,55.88 29.97,55.88 26.47,52.38 7.45,52.38 6.76,53.06 4.8,53.06 GPIOA.13
GPMI_RDY1
  Top 0.152: U1.21 40.14,68.05 33.03,60.95 30.57,60.95 25.5,55.87 9.94,55.87 9.17,56.64 9.17,63.35 6.76,65.76 5.94,65.76 4.95,64.77 GPIOA.3
GPMI_WPN
  Top 0.152: U1.34 44.93,62.08 44.93,61.3 44.8,61.17 40.85,61.17 30.48,50.8 5.08,50.8 GPIOA.15
GPMI_WRN
  Top 0.152: U1.33 40.56,62.15 30.48,52.07 GPIOA.14
HPL  (via drill 0.35)
  Top 0.152: U1.113 50.6,84.13 54.36,87.88 v56.39,87.88
  Bottom 0.152: GPIOC.1 75.18,92.46 72.91,90.18 63.34,90.18 61.55,88.39 56.9,88.39 v56.39,87.88
HPR  (via drill 0.35)
  Top 0.152: U1.109 52.2,84.29 55.14,87.23 56.66,87.23 57.05,87.61 57.05,90.27 55.88,91.44 v54.86,91.44 | v57.25,95 53.19,99.06 GPIOB.3
  Bottom 0.152: v57.25,95 57.25,93.54 55.01,91.3 v54.86,91.44
I2C_SCL
  Top 0.152: U1.127 44.93,77.62 44.93,78.44 43.81,79.55 41.15,79.55 39.61,81.09 I2C1.1
I2C_SDA
  Top 0.152: U1.128 44.6,78.34 43.69,79.25 39.62,79.25 37.61,81.26 I2C1.2
LINE1_INL  (via drill 0.35)
  Top 0.152: U1.115 49.8,84.85 52.17,87.23 52.17,87.65 52.91,88.38 54.9,88.38 55.88,89.37 v55.88,89.41
  Bottom 0.152: GPIOC.3 70.1,95.25 68.83,93.98 59.13,93.98 55.88,90.73 v55.88,89.41
LINE1_INR  (via drill 0.35)
  Top 0.152: U1.114 50.27,77.62 50.27,78.39 50.29,78.42 50.29,84.84 v52.83,87.38
  Bottom 0.152: GPIOC.2 70.61,96.27 70.61,93.27 58.93,93.27 56.9,91.24 56.9,89.41 54.86,87.38 v52.83,87.38
LRADC0  (via drill 0.35)
  Top 0.152: U1.108 52.6,84.1 53.35,84.1 54.4,85.14 60.25,85.14 v61.98,86.87 | v87.38,23.37 87.38,18.8 U$5.3
  Bottom 0.152: v87.38,23.37 74.32,36.42 74.32,84.6 70.06,88.86 63.97,88.86 v61.98,86.87
LRADC1  (via drill 0.35)
  Top 0.152: U1.107 53,77.72 52.98,77.71 52.98,75.42 52.83,75.27 v52.83,74.68 | v64.72,68.89 71.33,68.89 73.87,66.35 73.87,60.96 v77.52,60.96 | v63.5,26.42 64.41,27.33 66.29,27.33 75.39,36.43 75.39,41.36 v77.43,43.39 | v65.02,21.84 65.02,20.57 U$6.3 | v54.36,65.53 54.36,69.6 55.88,71.12 v55.88,71.63
  Bottom 0.152: v77.52,60.96 75.99,59.44 75.99,44.82 v77.43,43.39 | v63.5,26.42 65.02,24.89 v65.02,21.84 | v64.72,68.89 57.72,68.89 v54.36,65.53 | v55.88,71.63 v52.83,74.68
MIC  (via drill 0.35)
  Top 0.152: U1.116 49.4,85.47 v51.31,87.38
  Bottom 0.152: GPIOC.4 68.58,97.28 68.58,94.74 59.38,94.74 55.42,90.78 54.71,90.78 v51.31,87.38
N$1  (via drill 0.35)
  Top 0.152: U1.117 48.93,77.62 48.93,83.07 44.16,87.84 v40.6,87.84
  Bottom 0.152: v40.6,87.84 40.39,87.63 25.53,87.63 C36.1
N$2  (via drill 0.35)
  Top 0.152: v29.46,27.94 23.37,27.94 v19.81,31.5
  Bottom 0.152: IC1.2 12.17,31.5 v19.81,31.5 | v29.46,27.94 36.66,27.94 L3.1
N$3  (via drill 0.35)
  Top 0.152: v36.07,96.01 34.04,93.98 CLOSE.1 32.51,95 v33.02,95 | v21.84,31.14 12.7,40.28 12.7,46.74 15.09,49.13 15.51,49.13 15.9,49.51 15.9,49.93 16.11,50.14 v16.76,50.14 | v15.24,91.95 8.87,85.57 8.87,83.18 10.16,81.89 10.16,78.53 10.69,78 10.69,77.03 11.3,76.42 11.3,74.03 12.19,73.14 12.19,72.17 13.11,71.26 13.11,67.61 15.04,65.67 15.04,63.26 16.47,61.83 17.01,61.83 17.31,62.13 v21.34,62.13 | v42.16,97.03 44.2,97.03 v45.72,95.5
  Bottom 0.152: v21.84,31.14 22.64,30.34 26.99,30.34 28.37,28.96 39.54,28.96 L3.2 | v16.76,50.14 16.76,50.88 17.7,51.81 17.7,56.82 24.01,63.12 | C42.1 24.01,65.02 24.01,63.12 | v33.02,95 31.56,95 28.4,98.15 23.05,98.15 21.57,96.67 18.95,96.67 15.75,93.47 15.75,92.46 v15.24,91.95 | v21.34,62.13 22.33,63.12 24.01,63.12 | 47.6,95.74 47.99,95.35 52.34,95.35 C41.1 | R10.2 47.6,97.84 47.6,95.74 | v45.72,95.5 45.96,95.74 47.6,95.74 | v42.16,97.03 41.52,96.38 38.34,96.38 37.98,96.01 v36.07,96.01
N$4
  Top 0.152: DP.C R19.1
N$5  (via drill 0.35)
  Top 0.152: U$7.POWER 12.7,6.88 12.7,4.06 13.21,3.56 21.34,3.56 21.34,6.16 R21.1 23.88,5.52 v23.88,5.08 | U2.2 26.04,13.59 26.92,12.7 26.92,8.13 v23.88,5.08 | C51.+ 26.11,5.08 v23.88,5.08
  Bottom 0.152: v23.88,5.08 26.42,5.08 D2.A
N$6  (via drill 0.35)
  Top 0.152: U1.101 55.4,82.41 55.52,82.53 55.52,83.67 v55.37,83.82 | v46.28,83.31 45.45,84.14 v43.69,84.14 | v19.81,46.23 21.34,44.7 v23.88,44.7 | v24.38,42.82 24.38,40.39 D1.C
  Bottom 0.152: v55.37,83.82 51.82,83.82 51.31,83.31 v46.28,83.31 | v43.69,84.14 43.69,83.82 43.66,83.79 43.31,83.79 42.75,83.23 42.75,82.88 39.78,79.91 39.78,60.45 37.54,58.22 31.61,58.22 30.16,56.76 30.16,52.23 29.85,51.92 21.59,51.92 20.22,50.55 20.22,46.63 v19.81,46.23 | C12.1 24.01,44.7 v23.88,44.7 24.38,44.2 v24.38,42.82 | D1.C 34.46,30.31 36.09,30.31 36.93,29.46 40.64,29.46 42.67,27.43 45.21,27.43 46.1,26.55 C11.1
N$7
  Top 0.152: U1.2 43.03,75.58 39.9,75.58 30.75,66.43 28.3,66.43 23.34,61.47 16.38,61.47 14.73,63.12 14.73,65.55 12.8,67.48 12.8,71.13 11.89,72.05 11.89,73.02 11,73.91 11,76.29 10.39,76.9 10.39,77.87 9.86,78.41 9.86,81.76 8.56,83.06 8.56,86.41 7.34,87.63 7.34,89.31 6.76,89.89 5.94,89.89 4.95,88.9 LCD.1
N$8  (via drill 0.35)
  Top 0.152: v9.65,44.7 6.1,44.7 5.08,43.69 5.99,42.77 IC1.4 | v38.61,86.36 38.61,88.52 39.09,89 39.09,89.89 v40.13,90.93
  Bottom 0.152: v9.65,44.7 17.27,44.7 19.91,47.35 19.91,50.67 21.46,52.22 28.85,52.22 29.85,53.22 29.85,56.89 31.48,58.52 37.41,58.52 39.47,60.58 39.47,80.03 41.36,81.92 41.36,83.43 32.79,83.43 31.89,84.33 31.71,84.33 31.71,82.8 31.57,82.66 29.39,82.66 29.25,82.8 29.25,84.58 29.39,84.72 31.08,84.72 32.62,86.26 38.51,86.26 v38.61,86.36 | v40.13,90.93 44.04,94.84 | 44.04,94.84 R10.1 | 44.04,94.84 49.26,94.84 49.31,94.8 50.29,94.8 v50.8,94.29 51.39,94.29 51.81,93.87 54.37,93.87 C41.2 55.89,95 57.21,96.32 60.6,96.32 R11.2
N$9  (via drill 0.35)
  Top 0.152: v73.3,81.79 76.86,78.23 v78.23,78.23 | U$3.1 95.05,88.95 92.1,86 92.1,83.46 91.95,83.31 91.95,81.19 92.1,81.04 92.1,77.37 v91.44,76.71
  Bottom 0.152: v91.44,76.71 79.76,76.71 v78.23,78.23 | v73.3,81.79 v73.3,81.8 73.3,84.01 70.59,86.72 63.82,86.72 63.26,86.17 48.87,86.17 48.32,86.72 46.59,86.72 46.23,86.36 44.62,86.36 44.47,86.21 44.05,86.21 42.67,84.84 40.13,84.84 39.96,85.01 39.96,85.29 39.57,85.68 39.03,85.68 38.69,85.34 36.25,85.34 35.71,85.88 32.67,85.88 R8.2
N$10  (via drill 0.35)
  Top 0.152: v48.26,84.84 v47.03,86.06 | L1.2 79.5,92.46 74.68,92.46 72.64,90.42 71.63,90.42 v69.09,87.88 | U1.97 58.75,77.55 63.35,82.15 63.35,84.48 65.19,84.48 v65.19,85.85 65.02,85.85 v63.5,87.38
  Bottom 0.152: v69.09,87.88 69.09,87.38 v63.5,87.38 | C29.1 34.29,83.95 42.56,83.95 44.43,85.82 46.79,85.82 v47.03,86.06 | v65.19,85.85 49.28,85.85 v48.26,84.84
N$11  (via drill 0.35)
  Top 0.152: U1.99 56.2,83.82 56.71,84.33 v59.94,84.33 | L1.1 81.28,99.31 v81.28,99.57 79.25,99.57 v78.23,98.55 78.23,94.49 76.71,92.96 74.68,92.96 72.44,90.73 71,90.73 68.43,88.16 68.43,87.02 v69.6,85.85 | v34.04,96.52 34.82,97.31 37.31,97.31 v37.59,97.03
  Bottom 0.152: C28.1 16.28,84.18 15.48,84.18 6.6,93.05 6.6,98.55 8.56,100.51 28.02,100.51 32,96.52 v34.04,96.52 | v81.28,99.57 80.77,100.08 62.11,100.08 59.34,97.31 49.18,97.31 48.22,98.26 48.22,99.67 47.82,100.08 42.16,100.08 41.63,99.54 41.63,97.89 41.05,97.31 37.87,97.31 v37.59,97.03 | v59.94,84.33 61.05,84.33 61.7,84.99 67.21,84.99 68.07,85.85 v69.6,85.85
N$12
  Top 0.152: U1.3 40,75.25 30.87,66.13 28.43,66.13 23.46,61.16 16.26,61.16 14.43,62.99 14.43,65.42 12.5,67.35 12.5,71.01 11.58,71.92 11.58,72.89 10.69,73.78 10.69,76.17 10.08,76.78 10.08,77.75 9.55,78.28 9.55,81.64 8.26,82.93 8.26,86.29 6.35,88.19 LCD.2
N$13
  Top 0.152: U1.4 43.03,74.78 39.96,74.78 31,65.82 28.55,65.82 23.59,60.86 15.85,60.86 14.12,62.59 14.12,65.3 12.28,67.14 12.19,67.23 12.19,70.88 11.28,71.8 11.28,72.77 10.39,73.66 10.39,76.04 9.78,76.65 9.78,77.62 9.25,78.15 9.25,81.51 7.95,82.81 7.95,86.16 6.76,87.35 5.94,87.35 4.95,86.36 LCD.3
N$14
  Top 0.152: U1.5 43.03,74.38 39.99,74.38 31.13,65.52 28.68,65.52 23.71,60.55 14.99,60.55 14.89,60.45 14.89,60.81 13.82,61.87 13.82,65.17 11.89,67.1 11.89,70.75 10.97,71.67 10.97,72.64 10.08,73.53 10.08,75.92 9.47,76.52 9.47,77.49 8.94,78.03 8.94,81.38 7.64,82.68 7.64,84.36 6.35,85.65 LCD.4
N$15
  Top 0.152: U1.6 40.09,74.05 31.25,65.21 28.8,65.21 23.84,60.25 15.11,60.25 15.01,60.15 14.35,60.15 13.51,60.98 13.51,65.04 11.58,66.97 11.58,70.63 10.67,71.54 10.67,72.51 9.78,73.4 9.78,75.79 9.17,76.4 9.17,77.37 8.64,77.9 8.64,81.26 7.34,82.55 7.34,84.23 6.76,84.81 5.94,84.81 4.95,83.82 LCD.5
N$16
  Top 0.152: U1.7 40.12,73.65 31.38,64.91 28.93,64.91 23.97,59.94 15.24,59.94 15.14,59.84 14.22,59.84 13.21,60.86 13.21,64.92 11.28,66.85 11.28,70.5 10.36,71.42 10.36,72.39 9.47,73.28 9.47,75.66 8.87,76.27 8.87,77.24 8.26,77.85 8.26,81.21 6.35,83.11 LCD.6
N$17
  Top 0.152: U1.8 43.03,73.18 40.1,73.18 31.52,64.6 29.06,64.6 23.99,59.54 13.61,59.54 12.83,60.33 12.83,64.87 10.97,66.72 10.97,70.38 10.06,71.29 10.06,72.26 9.17,73.15 9.17,75.54 8.56,76.14 8.56,77.11 7.95,77.72 7.95,81.08 6.76,82.27 5.94,82.27 4.95,81.28 LCD.7
N$18  (via drill 0.35)
  Top 0.152: v88.9,15.75 88.64,15.49 88.64,6.13 85.36,2.85 77.2,2.85 64.81,15.24 60.96,15.24 60.45,14.73 55.37,14.73 54.86,15.24 v50.29,15.24 | v85.85,28.96 86.36,28.45 93.41,28.45 96.75,31.78 POWER/REC.1 | v4.57,91.95 4.57,91.06 2.82,89.31 2.82,49.12 5.71,46.23 v10.67,46.23 | v15.75,97.03 15.24,97.54 12.61,97.54 11.99,98.15 10.43,98.15 8.8,96.52 5.08,96.52 4.57,96.01 v4.57,95 | R15.2 39.62,94.61 v39.62,92.96 | v14.73,46.23 28.45,32.51 34.04,32.51 43.18,23.37 v43.18,17.27
  Bottom 0.152: v88.9,15.75 88.9,25.91 v85.85,28.96 | v4.57,91.95 v4.57,95 | v15.75,97.03 21.5,97.03 22.93,98.46 29.56,98.46 32.36,95.65 33.29,95.65 33.95,95 35.05,95 36.43,93.62 36.43,93.2 36.81,92.81 39.62,92.81 v39.62,92.96 | v14.73,46.23 v10.67,46.23 | v43.18,17.27 44.58,17.27 R17.1 49.78,14.73 v50.29,15.24
N$19
  Top 0.152: U$5.1 84.01,18.71 86.72,21.42 86.72,23.64 87.1,24.03 87.65,24.03 88.03,23.64 88.03,19.88 96.62,11.29 97.26,11.29 97.4,11.16 97.4,9.16 96.37,8.13 R16.2
N$20
  Top 0.152: U1.9 40.2,72.85 31.65,64.3 29.18,64.3 24.12,59.23 12.83,59.23 12.52,59.54 12.52,64.74 10.67,66.59 10.67,70.25 9.75,71.17 9.75,72.14 8.87,73.02 8.87,75.41 8.26,76.02 8.26,76.99 7.42,77.83 7.42,77.97 7.64,78.2 7.64,79.98 LCD.8
N$21